# EAGLE design automaton (EAGLE 6.4)

## Sheet 1 of 8: Power
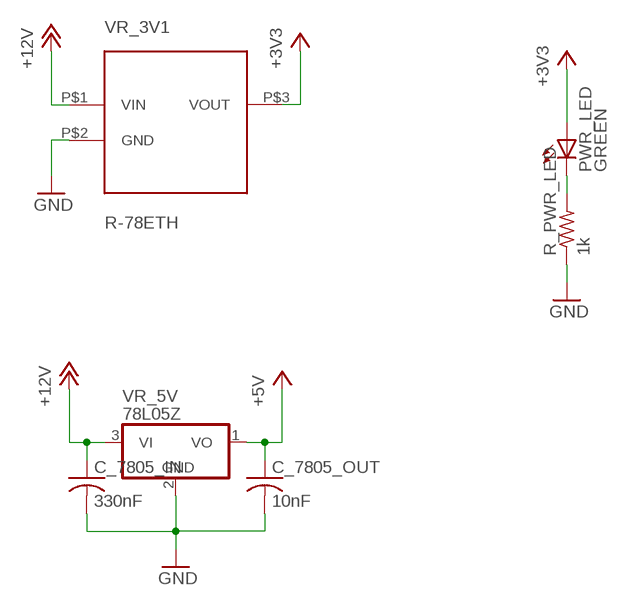
[diagram p0: schematic, sheet 1]

### Parts
C_7805_IN  330nF  C-USC1206  [C1206]
C_7805_OUT  10nF  C-USC1206  [C1206]
PWR_LED  GREEN  LEDCHIPLED_1206  [CHIPLED_1206]
R_PWR_LED  1k  R-US_R1206  [R1206]
VR_3V1  R-78ETH  [R-78E]
VR_5V  78L05Z  [TO92]

### Nets
+3V3 [3v3]: PWR_LED.A VR_3V1.P$3(VOUT) ; also sheet 2,3,4,5,6,7,8
+5V [5v]: C_7805_OUT.1 VR_5V.1(VO) ; also sheet 3
+12V [12v]: C_7805_IN.1 VR_3V1.P$1(VIN) VR_5V.3(VI) ; also sheet 3
GND [gnd]: C_7805_IN.2 C_7805_OUT.2 R_PWR_LED.1 VR_3V1.P$2(GND) VR_5V.2(GND) ; also sheet 2,3,4,5,6,7,8
N$24: PWR_LED.C R_PWR_LED.2

## Sheet 2 of 8: AVR
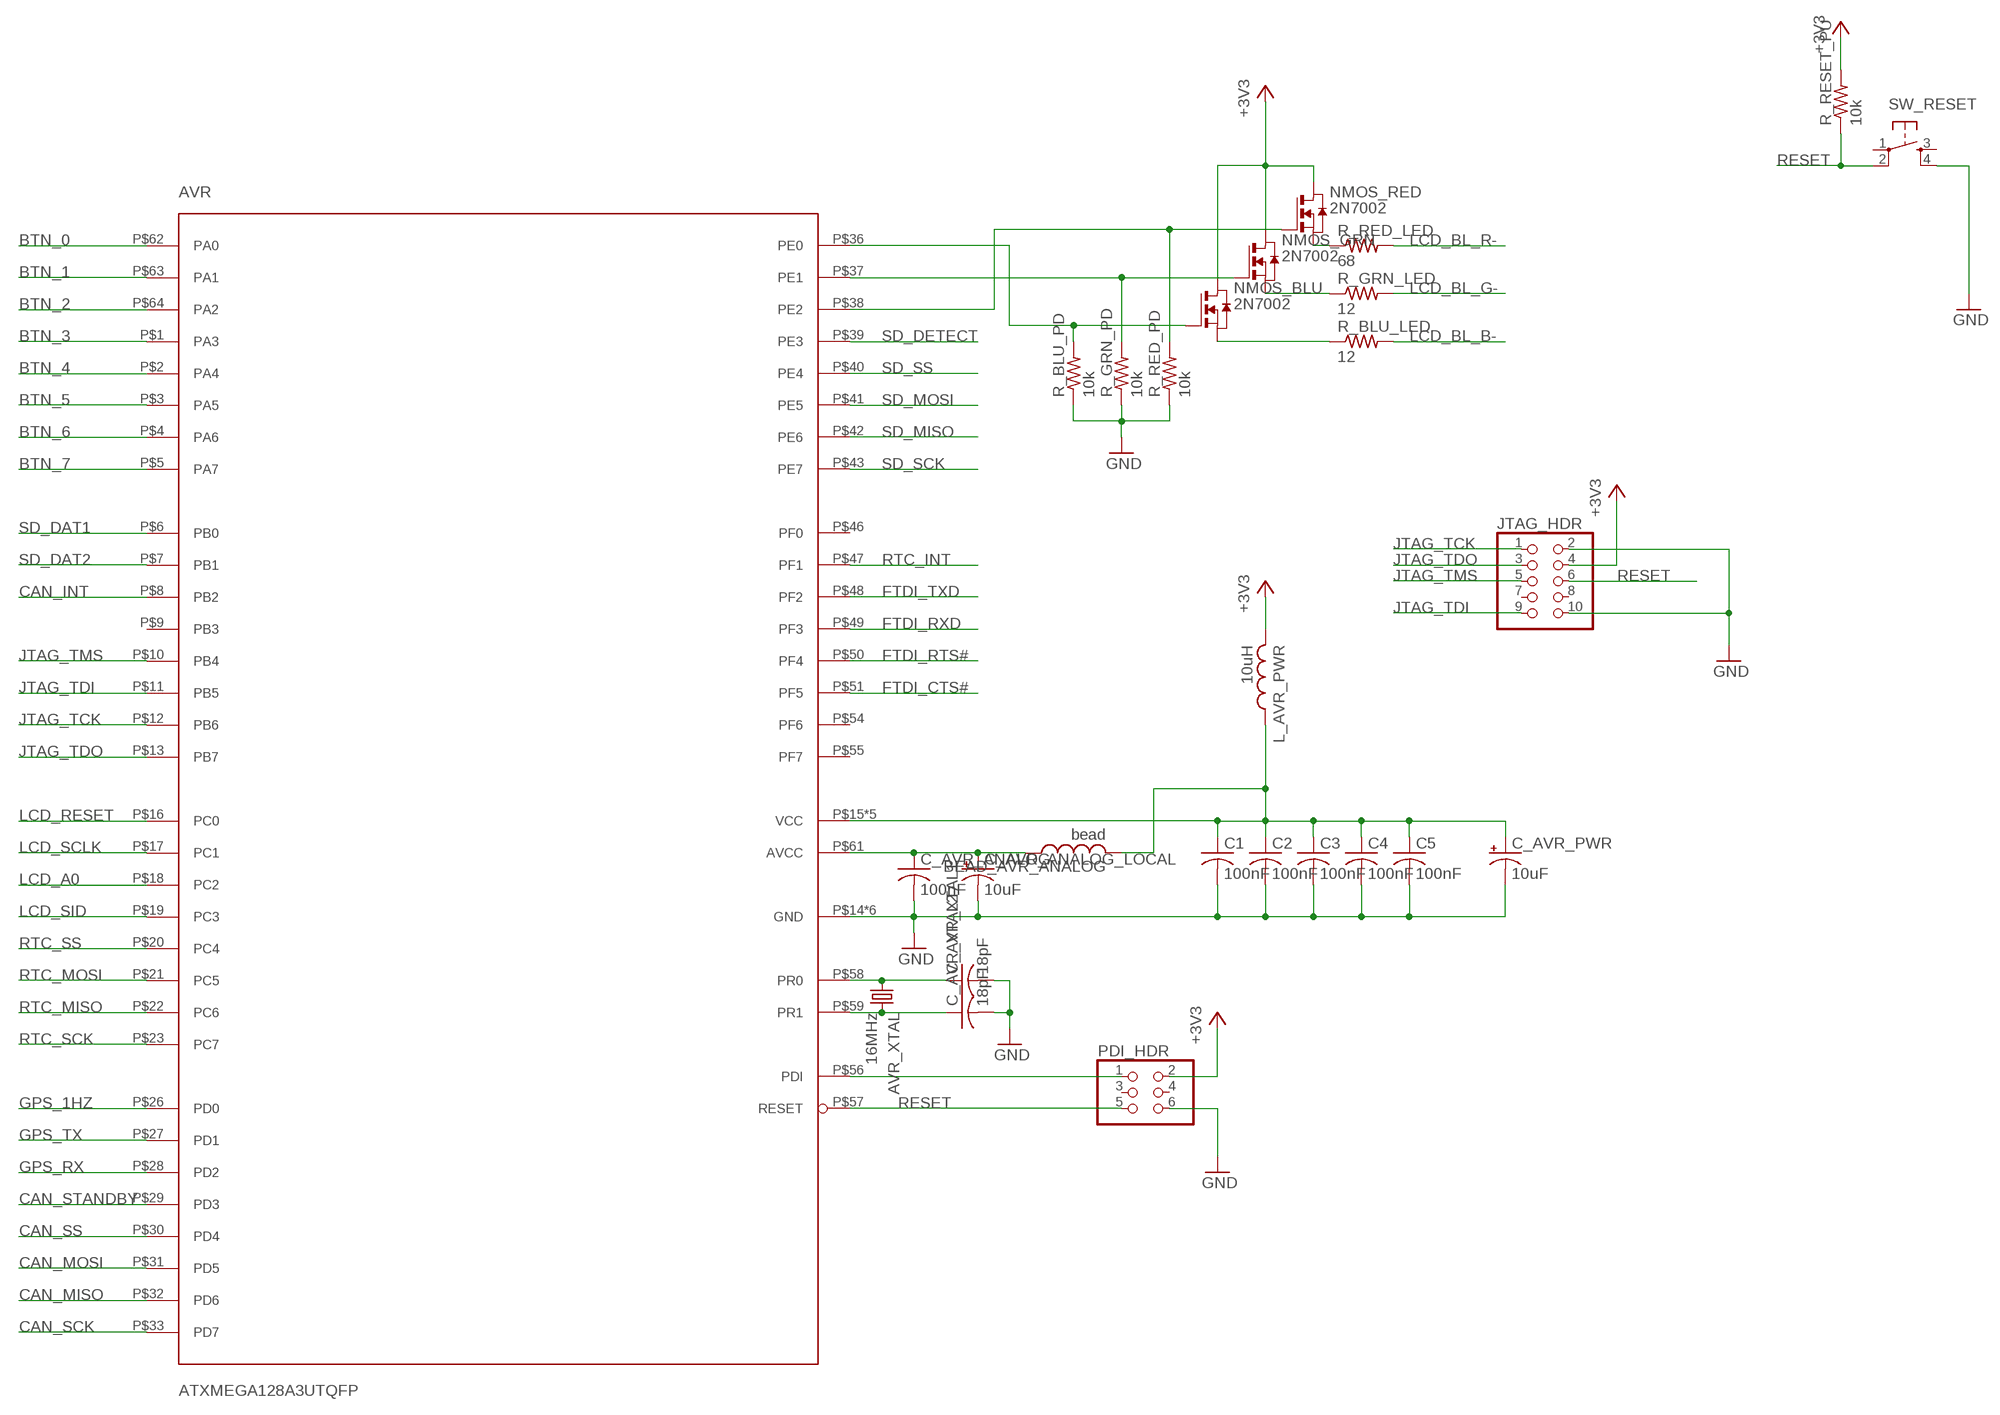
[diagram p1: schematic, sheet 2]

### Parts
AVR  ATXMEGA128A3UTQFP  [ATMEL_TQFP64]
AVR_XTAL  16MHz  CRYSTALHC49S  [HC49/S]
BEAD_AVR_ANALOG  bead  L-USL1812  [L1812]
C1  100nF  C-USC1206  [C1206]
C2  100nF  C-USC1206  [C1206]
C3  100nF  C-USC1206  [C1206]
C4  100nF  C-USC1206  [C1206]
C5  100nF  C-USC1206  [C1206]
C_AVR_ANALOG  100nF  C-USC1206  [C1206]
C_AVR_ANALOG_LOCAL  10uF  CPOL-USE2-5  [E2-5]
C_AVR_PWR  10uF  CPOL-USE2-5  [E2-5]
C_AVR_XTAL1  18pF  C-USC1206  [C1206]
C_AVR_XTAL2  18pF  C-USC1206  [C1206]
JTAG_HDR  PINHD-2X05_2.54  [2X05]
L_AVR_PWR  10uH  L-USL1812  [L1812]
NMOS_BLU  2N7002  NMOSSOT23  [SOT-23]
NMOS_GRN  2N7002  NMOSSOT23  [SOT-23]
NMOS_RED  2N7002  NMOSSOT23  [SOT-23]
PDI_HDR  PINHD-2X03_2.54  [2X03]
R_BLU_LED  12  R-US_R1206  [R1206]
R_BLU_PD  10k  R-US_R1206  [R1206]
R_GRN_LED  12  R-US_R1206  [R1206]
R_GRN_PD  10k  R-US_R1206  [R1206]
R_RED_LED  68  R-US_R1206  [R1206]
R_RED_PD  10k  R-US_R1206  [R1206]
R_RESET_PU  10k  R-US_R1206  [R1206]
SW_RESET  TAC_SWITCHSMD  [TACTILE_SWITCH_SMD]

### Nets
+3V3 [3v3]: JTAG_HDR.4 L_AVR_PWR.2 NMOS_BLU.1(D) NMOS_GRN.1(D) NMOS_RED.1(D) PDI_HDR.2 R_RESET_PU.2 ; also sheet 1,3,4,5,6,7,8
BTN_0: AVR.P$62(PA0) ; also sheet 6
BTN_1: AVR.P$63(PA1) ; also sheet 6
BTN_2: AVR.P$64(PA2) ; also sheet 6
BTN_3: AVR.P$1(PA3) ; also sheet 6
BTN_4: AVR.P$2(PA4) ; also sheet 6
BTN_5: AVR.P$3(PA5) ; also sheet 6
BTN_6: AVR.P$4(PA6) ; also sheet 6
BTN_7: AVR.P$5(PA7) ; also sheet 6
CAN_INT: AVR.P$8(PB2) ; also sheet 3
CAN_MISO: AVR.P$32(PD6) ; also sheet 3
CAN_MOSI: AVR.P$31(PD5) ; also sheet 3
CAN_SCK: AVR.P$33(PD7) ; also sheet 3
CAN_SS: AVR.P$30(PD4) ; also sheet 3
CAN_STANDBY: AVR.P$29(PD3) ; also sheet 3
FTDI_CTS#: AVR.P$51(PF5) ; also sheet 7
FTDI_RTS#: AVR.P$50(PF4) ; also sheet 7
FTDI_RXD: AVR.P$49(PF3) ; also sheet 7
FTDI_TXD: AVR.P$48(PF2) ; also sheet 7
GND [gnd]: AVR.P$14(GND) AVR.P$24(GND) AVR.P$34(GND) AVR.P$44(GND) AVR.P$52(GND) AVR.P$60(GND) C1.2 C2.2 C3.2 C4.2 C5.2 C_AVR_ANALOG.2 C_AVR_ANALOG_LOCAL.- C_AVR_PWR.- C_AVR_XTAL1.2 C_AVR_XTAL2.2 JTAG_HDR.2 JTAG_HDR.10 PDI_HDR.6 R_BLU_PD.1 R_GRN_PD.1 R_RED_PD.1 SW_RESET.4 ; also sheet 1,3,4,5,6,7,8
GPS_1HZ: AVR.P$26(PD0) ; also sheet 4
GPS_RX: AVR.P$28(PD2) ; also sheet 4
GPS_TX: AVR.P$27(PD1) ; also sheet 4
JTAG_TCK: AVR.P$12(PB6) JTAG_HDR.1
JTAG_TDI: AVR.P$11(PB5) JTAG_HDR.9
JTAG_TDO: AVR.P$13(PB7) JTAG_HDR.3
JTAG_TMS: AVR.P$10(PB4) JTAG_HDR.5
LCD_A0: AVR.P$18(PC2) ; also sheet 6
LCD_BL_B- [led]: R_BLU_LED.2 ; also sheet 6
LCD_BL_G- [led]: R_GRN_LED.2 ; also sheet 6
LCD_BL_R- [led]: R_RED_LED.2 ; also sheet 6
LCD_RESET: AVR.P$16(PC0) ; also sheet 6
LCD_SCLK: AVR.P$17(PC1) ; also sheet 6
LCD_SID: AVR.P$19(PC3) ; also sheet 6
N$6: AVR.P$58(PR0) AVR_XTAL.1 C_AVR_XTAL1.1
N$7: AVR.P$59(PR1) AVR_XTAL.2 C_AVR_XTAL2.1
N$18: AVR.P$37(PE1) NMOS_GRN.3(G) R_GRN_PD.2
N$19: AVR.P$36(PE0) NMOS_BLU.3(G) R_BLU_PD.2
N$23 [3v3]: AVR.P$61(AVCC) BEAD_AVR_ANALOG.1 C_AVR_ANALOG.1 C_AVR_ANALOG_LOCAL.+
N$27: AVR.P$38(PE2) NMOS_RED.3(G) R_RED_PD.2
N$28 [3v3]: AVR.P$15(VCC) AVR.P$25(VCC) AVR.P$35(VCC) AVR.P$45(VCC) AVR.P$53(VCC) BEAD_AVR_ANALOG.2 C1.1 C2.1 C3.1 C4.1 C5.1 C_AVR_PWR.+ L_AVR_PWR.1
N$29 [led]: NMOS_BLU.2(S) R_BLU_LED.1
N$30 [led]: NMOS_GRN.2(S) R_GRN_LED.1
N$31 [led]: NMOS_RED.2(S) R_RED_LED.1
PDI_DATA: AVR.P$56(PDI) PDI_HDR.1
RESET: AVR.P$57(RESET) JTAG_HDR.6 PDI_HDR.5 R_RESET_PU.1 SW_RESET.2
RTC_INT: AVR.P$47(PF1) ; also sheet 5
RTC_MISO: AVR.P$22(PC6) ; also sheet 5
RTC_MOSI: AVR.P$21(PC5) ; also sheet 5
RTC_SCK: AVR.P$23(PC7) ; also sheet 5
RTC_SS: AVR.P$20(PC4) ; also sheet 5
SD_DAT1: AVR.P$6(PB0) ; also sheet 8
SD_DAT2: AVR.P$7(PB1) ; also sheet 8
SD_DETECT: AVR.P$39(PE3) ; also sheet 8
SD_MISO: AVR.P$42(PE6) ; also sheet 8
SD_MOSI: AVR.P$41(PE5) ; also sheet 8
SD_SCK: AVR.P$43(PE7) ; also sheet 8
SD_SS: AVR.P$40(PE4) ; also sheet 8
Unconnected: AVR.P$9(PB3) AVR.P$46(PF0) AVR.P$54(PF6) AVR.P$55(PF7) JTAG_HDR.7 JTAG_HDR.8 PDI_HDR.3 PDI_HDR.4 SW_RESET.1 SW_RESET.3

## Sheet 3 of 8: CAN
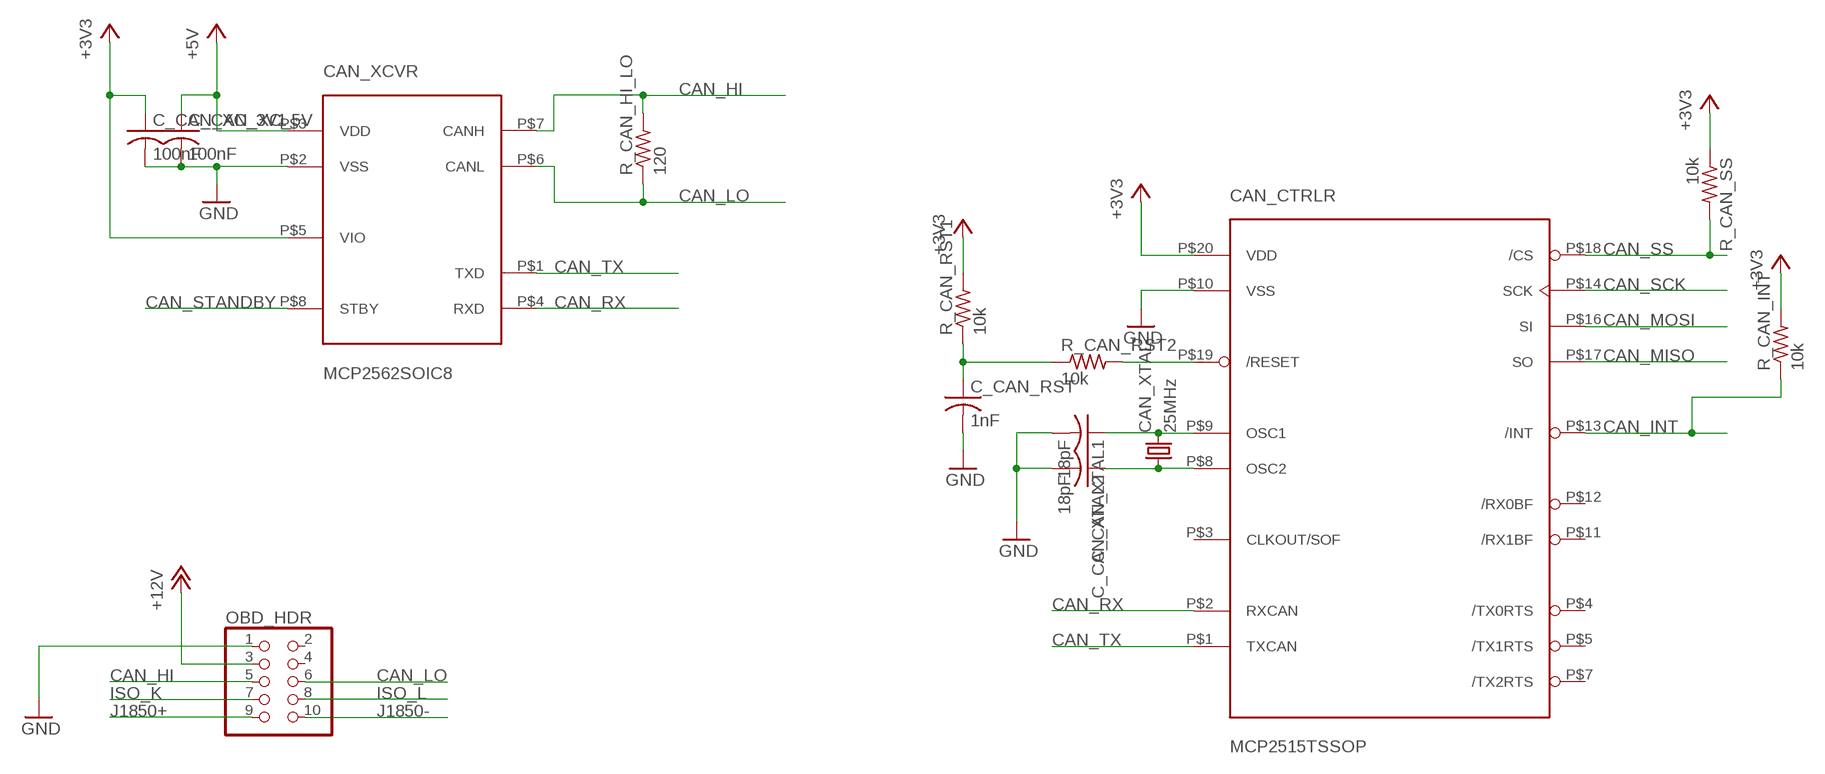
[diagram p2: schematic, sheet 3]

### Parts
C_CAN_RST  1nF  C-USC1206  [C1206]
C_CAN_XC_3V1  100nF  C-USC1206  [C1206]
C_CAN_XC_5V  100nF  C-USC1206  [C1206]
C_CAN_XTAL1  18pF  C-USC1206  [C1206]
C_CAN_XTAL2  18pF  C-USC1206  [C1206]
CAN_CTRLR  MCP2515TSSOP  [MICROCHIP_TSSOP20]
CAN_XCVR  MCP2562SOIC8  [MICROCHIP_SOIC8]
CAN_XTAL  25MHz  CRYSTALHC49S  [HC49/S]
OBD_HDR  PINHD-2X05_2.54-90°  [2X05/90]
R_CAN_HI_LO  120  R-US_R1206  [R1206]
R_CAN_INT  10k  R-US_R1206  [R1206]
R_CAN_RST1  10k  R-US_R1206  [R1206]
R_CAN_RST2  10k  R-US_R1206  [R1206]
R_CAN_SS  10k  R-US_R1206  [R1206]

### Nets
+3V3 [3v3]: C_CAN_XC_3V1.1 CAN_CTRLR.P$20(VDD) CAN_XCVR.P$5(VIO) R_CAN_INT.2 R_CAN_RST1.2 R_CAN_SS.1 ; also sheet 1,2,4,5,6,7,8
+5V [5v]: C_CAN_XC_5V.1 CAN_XCVR.P$3(VDD) ; also sheet 1
+12V [12v]: OBD_HDR.3 ; also sheet 1
CAN_HI: CAN_XCVR.P$7(CANH) OBD_HDR.5 R_CAN_HI_LO.2
CAN_INT: CAN_CTRLR.P$13(/INT) R_CAN_INT.1 ; also sheet 2
CAN_LO: CAN_XCVR.P$6(CANL) OBD_HDR.6 R_CAN_HI_LO.1
CAN_MISO: CAN_CTRLR.P$17(SO) ; also sheet 2
CAN_MOSI: CAN_CTRLR.P$16(SI) ; also sheet 2
CAN_RX: CAN_CTRLR.P$2(RXCAN) CAN_XCVR.P$4(RXD)
CAN_SCK: CAN_CTRLR.P$14(SCK) ; also sheet 2
CAN_SS: CAN_CTRLR.P$18(/CS) R_CAN_SS.2 ; also sheet 2
CAN_STANDBY: CAN_XCVR.P$8(STBY) ; also sheet 2
CAN_TX: CAN_CTRLR.P$1(TXCAN) CAN_XCVR.P$1(TXD)
GND [gnd]: C_CAN_RST.2 C_CAN_XC_3V1.2 C_CAN_XC_5V.2 C_CAN_XTAL1.2 C_CAN_XTAL2.2 CAN_CTRLR.P$10(VSS) CAN_XCVR.P$2(VSS) OBD_HDR.1 ; also sheet 1,2,4,5,6,7,8
ISO_K: OBD_HDR.7
ISO_L: OBD_HDR.8
J1850+: OBD_HDR.9
J1850-: OBD_HDR.10
N$5: C_CAN_RST.1 R_CAN_RST1.1 R_CAN_RST2.1
N$20: C_CAN_XTAL1.1 CAN_CTRLR.P$9(OSC1) CAN_XTAL.2
N$21: C_CAN_XTAL2.1 CAN_CTRLR.P$8(OSC2) CAN_XTAL.1
N$22: CAN_CTRLR.P$19(/RESET) R_CAN_RST2.2
Unconnected: CAN_CTRLR.P$3(CLKOUT/SOF) CAN_CTRLR.P$4(/TX0RTS) CAN_CTRLR.P$5(/TX1RTS) CAN_CTRLR.P$7(/TX2RTS) CAN_CTRLR.P$11(/RX1BF) CAN_CTRLR.P$12(/RX0BF) OBD_HDR.2 OBD_HDR.4

## Sheet 4 of 8: GPS
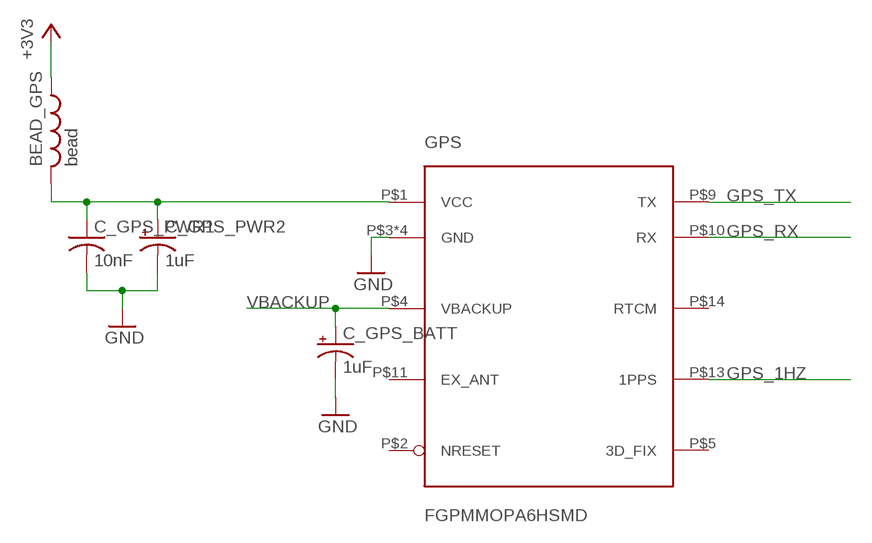
[diagram p3: schematic, sheet 4]

### Parts
BEAD_GPS  bead  L-USL1812  [L1812]
C_GPS_BATT  1uF  CPOL-USE2-5  [E2-5]
C_GPS_PWR1  10nF  C-USC1206  [C1206]
C_GPS_PWR2  1uF  CPOL-USE2-5  [E2-5]
GPS  FGPMMOPA6HSMD  [FGPMMOPA6H]

### Nets
+3V3 [3v3]: BEAD_GPS.1 ; also sheet 1,2,3,5,6,7,8
GND [gnd]: C_GPS_BATT.- C_GPS_PWR1.2 C_GPS_PWR2.- GPS.P$3(GND) GPS.P$8(GND) GPS.P$12(GND) GPS.P$19(GND) ; also sheet 1,2,3,5,6,7,8
GPS_1HZ: GPS.P$13(1PPS) ; also sheet 2
GPS_RX: GPS.P$10(RX) ; also sheet 2
GPS_TX: GPS.P$9(TX) ; also sheet 2
N$1 [3v3]: BEAD_GPS.2 C_GPS_PWR1.1 C_GPS_PWR2.+ GPS.P$1(VCC)
VBACKUP [vbatt]: C_GPS_BATT.+ GPS.P$4(VBACKUP) ; also sheet 5
Unconnected: GPS.P$2(NRESET) GPS.P$5(3D_FIX) GPS.P$11(EX_ANT) GPS.P$14(RTCM)

## Sheet 5 of 8: RTC
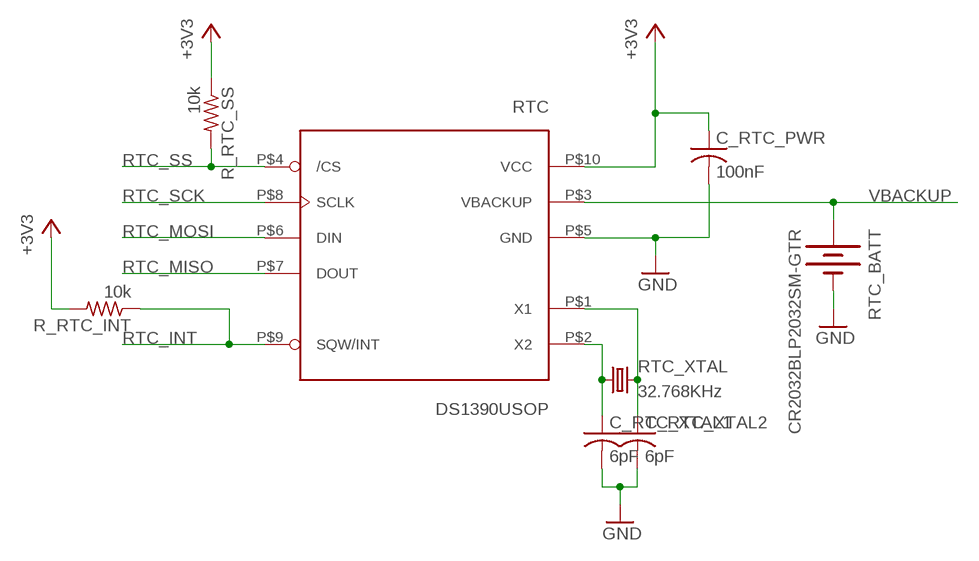
[diagram p4: schematic, sheet 5]

### Parts
C_RTC_PWR  100nF  C-USC1206  [C1206]
C_RTC_XTAL1  6pF  C-USC1206  [C1206]
C_RTC_XTAL2  6pF  C-USC1206  [C1206]
R_RTC_INT  10k  R-US_R1206  [R1206]
R_RTC_SS  10k  R-US_R1206  [R1206]
RTC  DS1390USOP  [MAXIM_10USOP]
RTC_BATT  CR2032BLP2032SM-GTR  [BLP2032SM-GTR]
RTC_XTAL  32.768KHz  CRYSTALTC26V  [TC26V]

### Nets
+3V3 [3v3]: C_RTC_PWR.1 R_RTC_INT.2 R_RTC_SS.1 RTC.P$10(VCC) ; also sheet 1,2,3,4,6,7,8
GND [gnd]: C_RTC_PWR.2 C_RTC_XTAL1.2 C_RTC_XTAL2.2 RTC.P$5(GND) RTC_BATT.P$2(-) ; also sheet 1,2,3,4,6,7,8
N$2: C_RTC_XTAL1.1 RTC.P$2(X2) RTC_XTAL.1
N$3: C_RTC_XTAL2.1 RTC.P$1(X1) RTC_XTAL.2
RTC_INT: R_RTC_INT.1 RTC.P$9(SQW/INT) ; also sheet 2
RTC_MISO: RTC.P$7(DOUT) ; also sheet 2
RTC_MOSI: RTC.P$6(DIN) ; also sheet 2
RTC_SCK: RTC.P$8(SCLK) ; also sheet 2
RTC_SS: R_RTC_SS.2 RTC.P$4(/CS) ; also sheet 2
VBACKUP [vbatt]: RTC.P$3(VBACKUP) RTC_BATT.P$1(+) ; also sheet 4

## Sheet 6 of 8: Front Panel
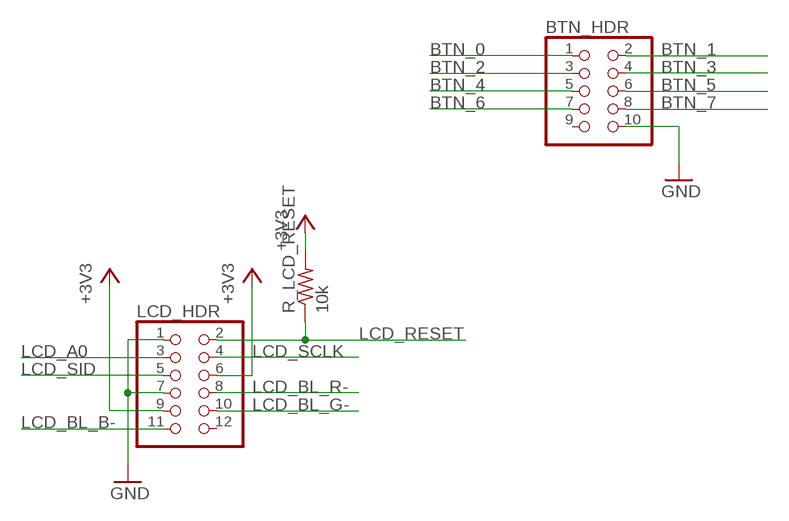
[diagram p5: schematic, sheet 6]

### Parts
BTN_HDR  PINHD-2X05_2.54  [2X05]
LCD_HDR  PINHD-2X06_2.54  [2X06]
R_LCD_RESET  10k  R-US_R1206  [R1206]

### Nets
+3V3 [3v3]: LCD_HDR.6 LCD_HDR.9 R_LCD_RESET.2 ; also sheet 1,2,3,4,5,7,8
BTN_0: BTN_HDR.1 ; also sheet 2
BTN_1: BTN_HDR.2 ; also sheet 2
BTN_2: BTN_HDR.3 ; also sheet 2
BTN_3: BTN_HDR.4 ; also sheet 2
BTN_4: BTN_HDR.5 ; also sheet 2
BTN_5: BTN_HDR.6 ; also sheet 2
BTN_6: BTN_HDR.7 ; also sheet 2
BTN_7: BTN_HDR.8 ; also sheet 2
GND [gnd]: BTN_HDR.10 LCD_HDR.1 LCD_HDR.7 ; also sheet 1,2,3,4,5,7,8
LCD_A0: LCD_HDR.3 ; also sheet 2
LCD_BL_B- [led]: LCD_HDR.11 ; also sheet 2
LCD_BL_G- [led]: LCD_HDR.10 ; also sheet 2
LCD_BL_R- [led]: LCD_HDR.8 ; also sheet 2
LCD_RESET: LCD_HDR.2 R_LCD_RESET.1 ; also sheet 2
LCD_SCLK: LCD_HDR.4 ; also sheet 2
LCD_SID: LCD_HDR.5 ; also sheet 2
Unconnected: BTN_HDR.9 LCD_HDR.12

## Sheet 7 of 8: USB
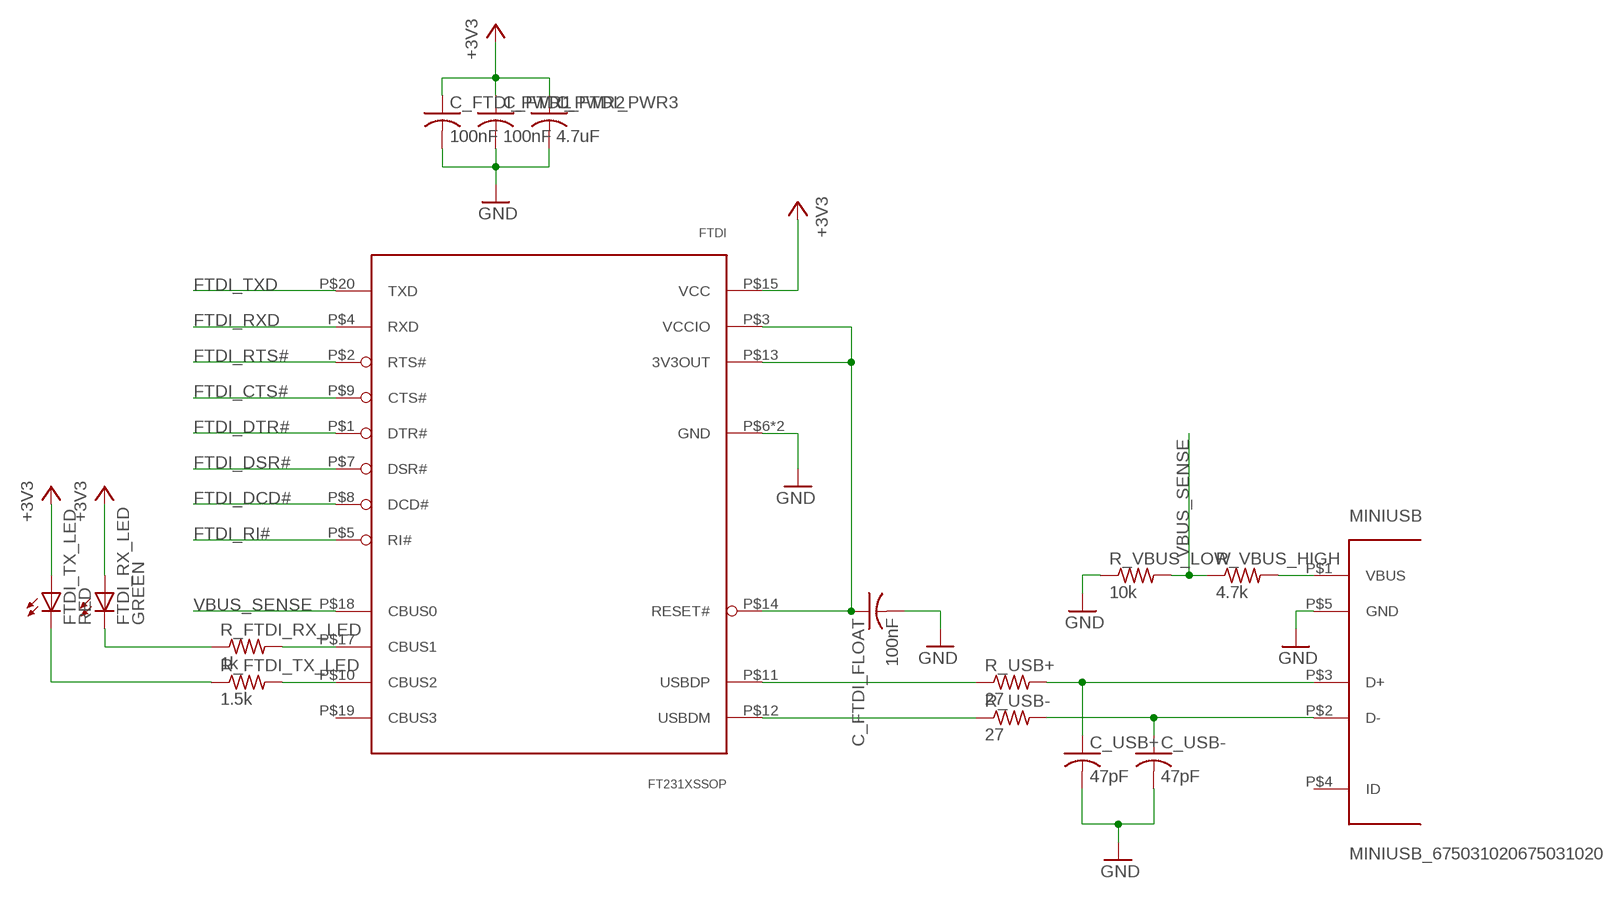
[diagram p6: schematic, sheet 7]

### Parts
C_FTDI_FLOAT  100nF  C-USC1206  [C1206]
C_FTDI_PWR1  100nF  C-USC1206  [C1206]
C_FTDI_PWR2  100nF  C-USC1206  [C1206]
C_FTDI_PWR3  4.7uF  C-USC1206  [C1206]
C_USB+  47pF  C-USC1206  [C1206]
C_USB-  47pF  C-USC1206  [C1206]
FTDI  FT231XSSOP  [FTDI_SSOP20]
FTDI_RX_LED  GREEN  LEDCHIPLED_1206  [CHIPLED_1206]
FTDI_TX_LED  RED  LEDCHIPLED_1206  [CHIPLED_1206]
MINIUSB  MINIUSB_675031020675031020  [MINIUSB_675031020]
R_FTDI_RX_LED  1k  R-US_R1206  [R1206]
R_FTDI_TX_LED  1.5k  R-US_R1206  [R1206]
R_USB+  27  R-US_R1206  [R1206]
R_USB-  27  R-US_R1206  [R1206]
R_VBUS_HIGH  4.7k  R-US_R1206  [R1206]
R_VBUS_LOW  10k  R-US_R1206  [R1206]

### Nets
+3V3 [3v3]: C_FTDI_PWR1.1 C_FTDI_PWR2.1 C_FTDI_PWR3.1 FTDI.P$15(VCC) FTDI_RX_LED.A FTDI_TX_LED.A ; also sheet 1,2,3,4,5,6,8
FTDI_CTS#: FTDI.P$9(CTS#) ; also sheet 2
FTDI_DCD#: FTDI.P$8(DCD#)
FTDI_DSR#: FTDI.P$7(DSR#)
FTDI_DTR#: FTDI.P$1(DTR#)
FTDI_RI#: FTDI.P$5(RI#)
FTDI_RTS#: FTDI.P$2(RTS#) ; also sheet 2
FTDI_RXD: FTDI.P$4(RXD) ; also sheet 2
FTDI_TXD: FTDI.P$20(TXD) ; also sheet 2
GND [gnd]: C_FTDI_FLOAT.2 C_FTDI_PWR1.2 C_FTDI_PWR2.2 C_FTDI_PWR3.2 C_USB+.2 C_USB-.2 FTDI.P$6(GND) FTDI.P$16(GND) MINIUSB.P$5(GND) R_VBUS_LOW.1 ; also sheet 1,2,3,4,5,6,8
N$4: C_FTDI_FLOAT.1 FTDI.P$3(VCCIO) FTDI.P$13(3V3OUT) FTDI.P$14(RESET#)
N$8: FTDI_RX_LED.C R_FTDI_RX_LED.1
N$9: C_USB+.1 MINIUSB.P$3(D+) R_USB+.2
N$10: C_USB-.1 MINIUSB.P$2(D-) R_USB-.2
N$11: FTDI_TX_LED.C R_FTDI_TX_LED.1
N$12: FTDI.P$10(CBUS2) R_FTDI_TX_LED.2
N$13: FTDI.P$17(CBUS1) R_FTDI_RX_LED.2
N$17: MINIUSB.P$1(VBUS) R_VBUS_HIGH.2
USB_N: FTDI.P$12(USBDM) R_USB-.1
USB_P: FTDI.P$11(USBDP) R_USB+.1
VBUS_SENSE: FTDI.P$18(CBUS0) R_VBUS_HIGH.1 R_VBUS_LOW.2
Unconnected: FTDI.P$19(CBUS3) MINIUSB.P$4(ID)

## Sheet 8 of 8: MicroSD
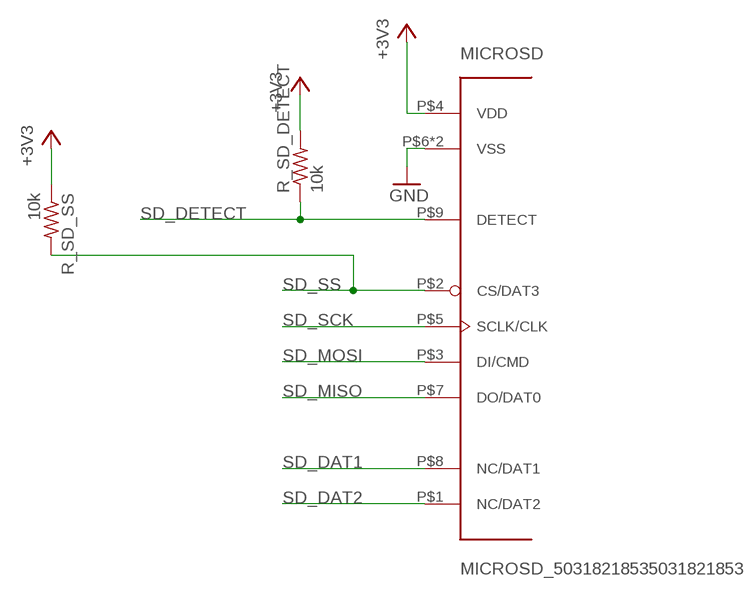
[diagram p7: schematic, sheet 8]

### Parts
MICROSD  MICROSD_50318218535031821853  [MICROSD_5031821853]
R_SD_DETECT  10k  R-US_R1206  [R1206]
R_SD_SS  10k  R-US_R1206  [R1206]

### Nets
+3V3 [3v3]: MICROSD.P$4(VDD) R_SD_DETECT.2 R_SD_SS.1 ; also sheet 1,2,3,4,5,6,7
GND [gnd]: MICROSD.P$6(VSS) MICROSD.P$10(VSS) ; also sheet 1,2,3,4,5,6,7
SD_DAT1: MICROSD.P$8(NC/DAT1) ; also sheet 2
SD_DAT2: MICROSD.P$1(NC/DAT2) ; also sheet 2
SD_DETECT: MICROSD.P$9(DETECT) R_SD_DETECT.1 ; also sheet 2
SD_MISO: MICROSD.P$7(DO/DAT0) ; also sheet 2
SD_MOSI: MICROSD.P$3(DI/CMD) ; also sheet 2
SD_SCK: MICROSD.P$5(SCLK/CLK) ; also sheet 2
SD_SS: MICROSD.P$2(CS/DAT3) R_SD_SS.2 ; also sheet 2

## Library data of the parts
AVR = automaton:ATXMEGA128A3U
AVR_XTAL CAN_XTAL = crystal:CRYSTAL: CRYSTAL; OC_FARNELL: 1667008; OC_NEWARK: unknown
BEAD_AVR_ANALOG BEAD_GPS L_AVR_PWR = rcl:L-US: INDUCTOR, American symbol
BTN_HDR JTAG_HDR OBD_HDR = pinhead-2:PINHD-2X05: PIN HEADER
C1-C5 C_7805_IN C_7805_OUT C_AVR_ANALOG C_AVR_XTAL1 C_AVR_XTAL2 C_CAN_RST C_CAN_XC_3V1 C_CAN_XC_5V C_CAN_XTAL1 C_CAN_XTAL2 C_FTDI_FLOAT C_FTDI_PWR1-C_FTDI_PWR3 C_GPS_PWR1 C_RTC_PWR C_RTC_XTAL1 C_RTC_XTAL2 C_USB+ C_USB- = rcl:C-US: CAPACITOR, American symbol
C_AVR_ANALOG_LOCAL C_AVR_PWR C_GPS_BATT C_GPS_PWR2 = rcl:CPOL-US: POLARIZED CAPACITOR, American symbol
CAN_CTRLR = automaton:MCP2515
CAN_XCVR = automaton:MCP2562
FTDI = automaton:FT231X
FTDI_RX_LED FTDI_TX_LED PWR_LED = led:LED: LED OSRAM: - CHIPLED LG R971, LG N971, LY N971, LG Q971, LY Q971, LO R971, LY R971 LH N974, LH R974 LS Q976, LO Q976, LY Q976 LO Q996 - Hyper CHIPLED LW Q18S LB Q993, LB Q99A, LB R99A - SideLED LS A670, LO A670, LY A670, LG A670, LP A670 LB A673, LV A673, LT A673, LW A673 LH A674 LY A675 LS A676, LA A676, LO A676, LY A676, LW A676 LS A679, LY A679, LG A679 - Hyper Micro SIDELED® LS Y876, LA Y876, LO Y876, LY Y876 LT Y87S - SmartLED LW L88C, LW L88S LB L89C, LB L89S, LG L890 LS L89K, LO L89K, LY L89K LS L896, LA L896, LO L896, LY L896 - TOPLED LS T670, LO T670, LY T670, LG T670, LP T670 LSG T670, LSP T670, LSY T670, LOP T670, LYG T670 LG T671, LOG T671, LSG T671 LB T673, LV T673, LT T673, LW T673 LH T674 LS T676, LA T676, LO T676, LY T676, LB T676, LH T676, LSB T676, LW T676 LB T67C, LV T67C, LT T67C, LS T67K, LO T67K, LY T67K, LW E67C LS E67B, LA E67B, LO E67B, LY E67B, LB E67C, LV E67C, LT E67C LW T67C LS T679, LY T679, LG T679 LS T770, LO T770, LY T770, LG T770, LP T770 LB T773, LV T773, LT T773, LW T773 LH T774 LS E675, LA E675, LY E675, LS T675 LS T776, LA T776, LO T776, LY T776, LB T776 LHGB T686 LT T68C, LB T68C - Hyper Mini TOPLED® LB M676 - Mini TOPLED Santana® LG M470 LS M47K, LO M47K, LY M47K Source: http://www.osram.convergy.de LUXEON: - LUMILED® LXK2-PW12-R00, LXK2-PW12-S00, LXK2-PW14-U00, LXK2-PW14-V00 LXK2-PM12-R00, LXK2-PM12-S00, LXK2-PM14-U00 LXK2-PE12-Q00, LXK2-PE12-R00, LXK2-PE12-S00, LXK2-PE14-T00, LXK2-PE14-U00 LXK2-PB12-K00, LXK2-PB12-L00, LXK2-PB12-M00, LXK2-PB14-N00, LXK2-PB14-P00, LXK2-PB14-Q00 LXK2-PR12-L00, LXK2-PR12-M00, LXK2-PR14-Q00, LXK2-PR14-R00 LXK2-PD12-Q00, LXK2-PD12-R00, LXK2-PD12-S00 LXK2-PH12-R00, LXK2-PH12-S00 LXK2-PL12-P00, LXK2-PL12-Q00, LXK2-PL12-R00 Source: www.luxeon.com KINGBRIGHT: KA-3528ASYC Source: www.kingbright.com
GPS = automaton:FGPMMOPA6H
LCD_HDR = pinhead-2:PINHD-2X06: PIN HEADER
MICROSD = automaton:MICROSD_5031821853
MINIUSB = automaton:MINIUSB_675031020
NMOS_BLU NMOS_GRN NMOS_RED = zetex:NMOSSOT23: MOS FET; OC_FARNELL: unknown; OC_NEWARK: unknown
PDI_HDR = pinhead-2:PINHD-2X03: PIN HEADER
R_BLU_LED R_BLU_PD R_CAN_HI_LO R_CAN_INT R_CAN_RST1 R_CAN_RST2 R_CAN_SS R_FTDI_RX_LED R_FTDI_TX_LED R_GRN_LED R_GRN_PD R_LCD_RESET R_PWR_LED R_RED_LED R_RED_PD R_RESET_PU R_RTC_INT R_RTC_SS R_SD_DETECT R_SD_SS R_USB+ R_USB- R_VBUS_HIGH R_VBUS_LOW = rcl:R-US_: RESISTOR, American symbol
RTC = automaton:DS1390
RTC_BATT = automaton:CR2032
RTC_XTAL = crystal:CRYSTAL: CRYSTAL; OC_FARNELL: unknown; OC_NEWARK: unknown
SW_RESET = SparkFun:TAC_SWITCH: Momentary Switch Button commonly used for reset or general input. Spark Fun Electronics SKU : COM-00097
VR_3V1 = automaton:R-78E
VR_5V = linear:78*: Positive VOLTAGE REGULATOR Source: http://cache.national.com/ds/LM/LM78L05.pdf http://www.fairchildsemi.com/ds/LM/LM7805.pdf

## Net classes
0 default: width 0.2 mm, clearance 0.2 mm
1 gnd: width 0.3 mm, clearance 0.2 mm
2 12v: width 0.6 mm, clearance 0.4 mm
3 3v3: width 0.3 mm, clearance 0.2 mm
4 vbatt: width 0.2 mm, clearance 0.2 mm
5 5v: width 0.3 mm, clearance 0.2 mm
6 led: width 0.3 mm, clearance 0.2 mm

## Board
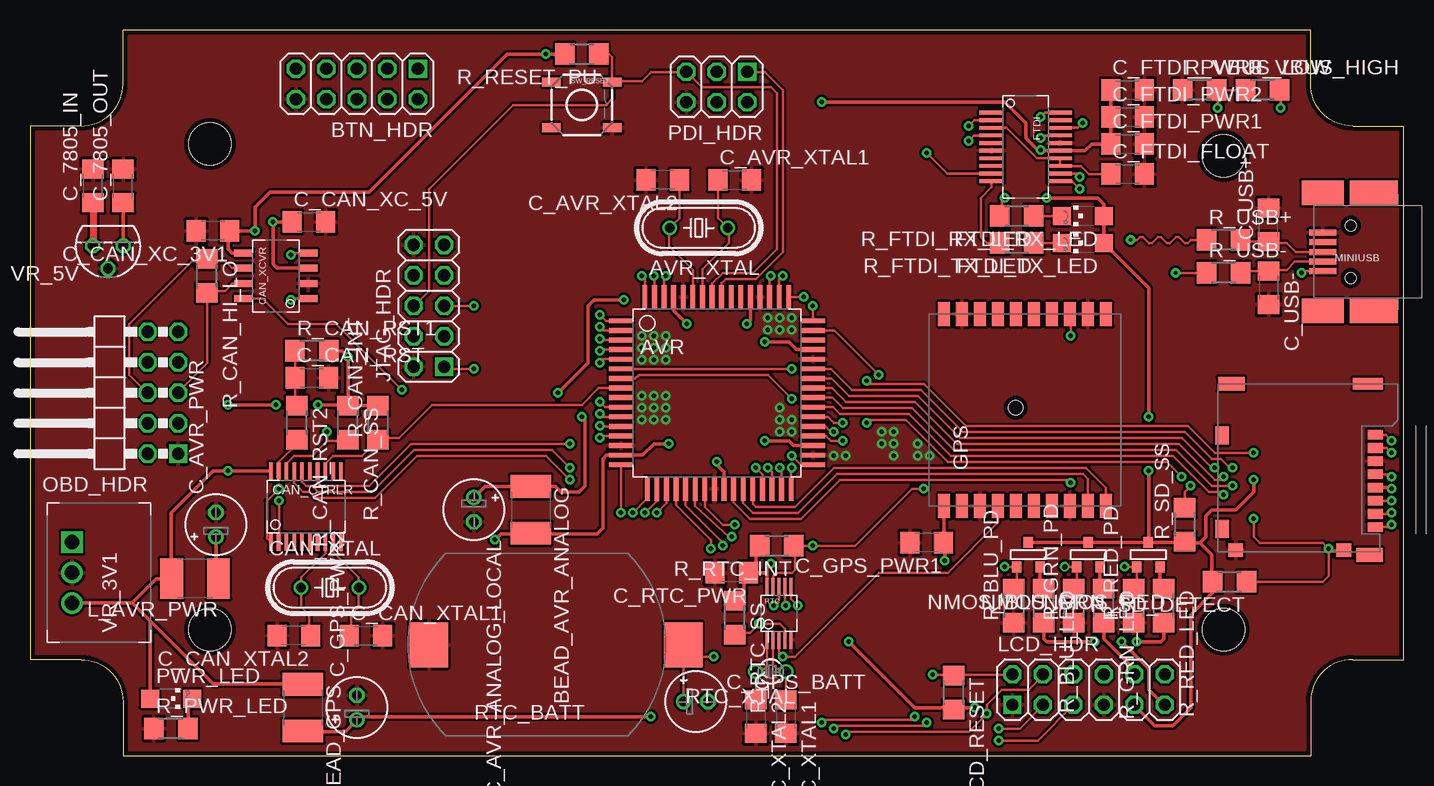
[diagram p8: board, top side]
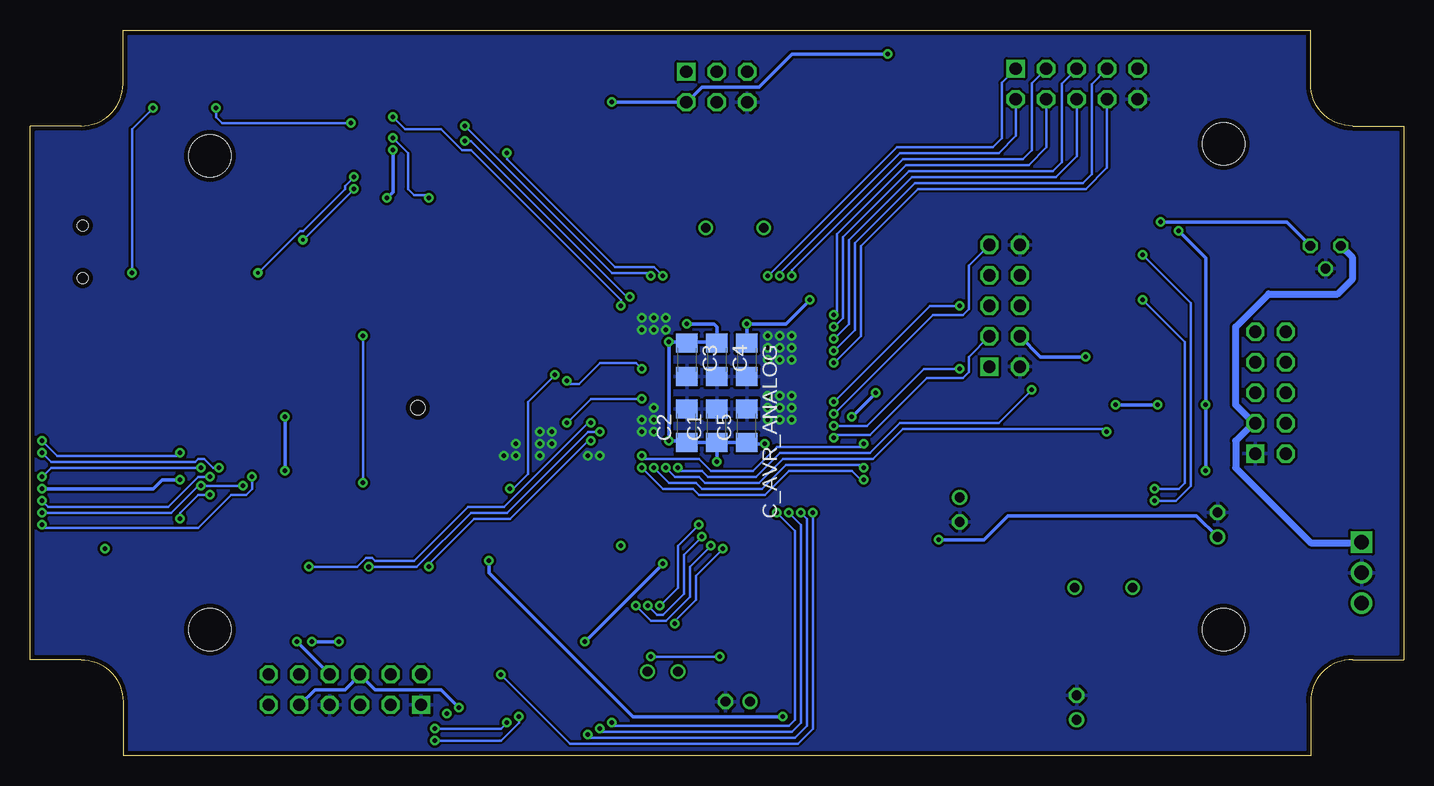
[diagram p9: board, bottom side, seen from below]

Size 114.5 x 60.5 mm. Coordinates in mm from the lower left corner, seen from the top.
Outline: 4.25,8 arc-90 7.75,4.5 7.75,0 106.75,0 106.75,4.5 arc-90 110.25,8 114.5,8 114.5,52.5 110.25,52.5 arc-90 106.75,56 106.75,60.5 7.75,60.5 7.75,56 arc-90 4.25,52.5 0,52.5 0,8 4.25,8
Copper layers (1*16): Top 0.0356mm / dielectric 1.5011mm / Bottom 0.0356mm
Design rules "LaenPCBOrder": minimum track width 6mil, minimum drill 13mil, track to track 6mil, track to pad 6mil, pad to pad 6mil, via to via 6mil, smd to smd 6mil, copper to edge 15mil, drill to drill 6mil, minimum pad ring 7mil, minimum via ring 7mil, stop-mask expansion 3mil, vias tented up to drill 0mil, thermal gap 10mil
Holes 3.5 mm at 15,10.5 99.5,10.5 15,51 99.5,50

### Footprints (pad centres in the part's own frame; a part is rotated, then mirrored left to right if it is on the bottom)
ATMEL_TQFP64 = smd 2 x 0.4: P$1 -8,6; P$2 -8,5.2; P$3 -8,4.4; P$4 -8,3.6; P$5 -8,2.8; P$6 -8,2; P$7 -8,1.2; P$8 -8,0.4; P$9 -8,-0.4; P$10 -8,-1.2; P$11 -8,-2; P$12 -8,-2.8; P$13 -8,-3.6; P$14 -8,-4.4; P$15 -8,-5.2; P$16 -8,-6; P$33 8,-6; P$34 8,-5.2; P$35 8,-4.4; P$36 8,-3.6; P$37 8,-2.8; P$38 8,-2; P$39 8,-1.2; P$40 8,-0.4; P$41 8,0.4; P$42 8,1.2; P$43 8,2; P$44 8,2.8; P$45 8,3.6; P$46 8,4.4; P$47 8,5.2; P$48 8,6 | smd 0.4 x 2: P$17 -5.8,-8; P$18 -5,-8; P$19 -4.2,-8; P$20 -3.4,-8; P$21 -2.6,-8; P$22 -1.8,-8; P$23 -1,-8; P$24 -0.2,-8; P$25 0.6,-8; P$26 1.4,-8; P$27 2.2,-8; P$28 3,-8; P$29 3.8,-8; P$30 4.6,-8; P$31 5.4,-8; P$32 6.2,-8; P$49 6,8; P$50 5.2,8; P$51 4.4,8; P$52 3.6,8; P$53 2.8,8; P$54 2,8; P$55 1.2,8; P$56 0.4,8; P$57 -0.4,8; P$58 -1.2,8; P$59 -2,8; P$60 -2.8,8; P$61 -3.6,8; P$62 -4.4,8; P$63 -5.2,8; P$64 -6,8
HC49/S = drill 0.813: 1 -2.413,0; 2 2.413,0
L1812 = smd 1.9 x 3.4: 1 -1.95,0; 2 1.95,0
2X05 = drill 1.016 square: 1 -5.08,-1.27 | drill 1.016 octagon: 2 -5.08,1.27; 3 -2.54,-1.27; 4 -2.54,1.27; 5 0,-1.27; 6 0,1.27; 7 2.54,-1.27; 8 2.54,1.27; 9 5.08,-1.27; 10 5.08,1.27
C1206 = smd 1.6 x 1.8: 1 -1.4,0; 2 1.4,0
E2-5 = drill 0.813 pad 1.27: + -1.016,0 | drill 0.813 pad 1.27 octagon: - 1.016,0
MICROCHIP_TSSOP20 = smd 0.3 x 1.5: P$1 -2.925,-2.95; P$2 -2.275,-2.95; P$3 -1.625,-2.95; P$4 -0.975,-2.95; P$5 -0.325,-2.95; P$6 0.325,-2.95; P$7 0.975,-2.95; P$8 1.625,-2.95; P$9 2.275,-2.95; P$10 2.925,-2.95; P$11 2.925,2.95; P$12 2.275,2.95; P$13 1.625,2.95; P$14 0.975,2.95; P$15 0.325,2.95; P$16 -0.325,2.95; P$17 -0.975,2.95; P$18 -1.625,2.95; P$19 -2.275,2.95; P$20 -2.925,2.95
MICROCHIP_SOIC8 = smd 0.6 x 1.55: P$1 -1.905,-2.7; P$2 -0.635,-2.7; P$3 0.635,-2.7; P$4 1.905,-2.7; P$5 1.905,2.7; P$6 0.635,2.7; P$7 -0.635,2.7; P$8 -1.905,2.7
FTDI_SSOP20 = smd 0.318 x 2.032: P$1 -2.857,-2.857; P$2 -2.223,-2.857; P$3 -1.587,-2.857; P$4 -0.953,-2.857; P$5 -0.318,-2.857; P$6 0.318,-2.857; P$7 0.953,-2.857; P$8 1.587,-2.857; P$9 2.223,-2.857; P$10 2.857,-2.857; P$11 2.857,2.857; P$12 2.223,2.857; P$13 1.587,2.857; P$14 0.953,2.857; P$15 0.318,2.857; P$16 -0.318,2.857; P$17 -0.953,2.857; P$18 -1.587,2.857; P$19 -2.223,2.857; P$20 -2.857,2.857
CHIPLED_1206 = smd 1.5 x 1.5: A 0,-1.75; C 0,1.75
FGPMMOPA6H = smd 2 x 1: P$1 -8,6.75; P$2 -8,5.25; P$3 -8,3.75; P$4 -8,2.25; P$5 -8,0.75; P$6 -8,-0.75; P$7 -8,-2.25; P$8 -8,-3.75; P$9 -8,-5.25; P$10 -8,-6.75; P$11 8,-6.75; P$12 8,-5.25; P$13 8,-3.75; P$14 8,-2.25; P$15 8,-0.75; P$16 8,0.75; P$17 8,2.25; P$18 8,3.75; P$19 8,5.25; P$20 8,6.75 | hole 1.2: 0.2,0.8
2X06 = drill 1.016 square: 1 -6.35,-1.27 | drill 1.016 octagon: 2 -6.35,1.27; 3 -3.81,-1.27; 4 -3.81,1.27; 5 -1.27,-1.27; 6 -1.27,1.27; 7 1.27,-1.27; 8 1.27,1.27; 9 3.81,-1.27; 10 3.81,1.27; 11 6.35,-1.27; 12 6.35,1.27
MICROSD_5031821853 = smd 0.8 x 1.25: P$1 4.95,5.625; P$2 3.85,5.625; P$3 2.75,5.625; P$4 1.65,5.625; P$5 0.55,5.625; P$6 -0.55,5.625; P$7 -1.65,5.625; P$8 -2.75,5.625 | smd 1.15 x 1.25: P$9 6.875,3 | smd 1.15 x 1.2: P$10 6.875,-6 | smd 0.95 x 2.5: P$11 -7,5 | smd 1.15 x 2.2: P$12 -7,-6.35; P$13 7.275,5.175 | smd 1.5 x 1.15: P$14 -2.7,-7.125; P$15 5.1,-7.125
MINIUSB_675031020 = smd 2.25 x 0.5: P$1 3.75,1.6; P$2 3.75,0.8; P$3 3.75,0; P$4 3.75,-0.8; P$5 3.75,-1.6 | smd 4 x 2.05: P$6 -0.5,-4.925; P$7 -0.5,4.925 | smd 3.5 x 2.05: P$8 3.75,-4.925; P$9 3.75,4.925 | hole 0.9: 1.4,2.2; 1.4,-2.2
SOT-23 = smd 0.787 x 0.889: 1 0.025,-1.016; 2 -0.94,1.016; 3 0.991,1.016
2X05/90 = drill 1.016 square: 1 -5.08,-6.35 | drill 1.016 octagon: 2 -5.08,-3.81; 3 -2.54,-6.35; 4 -2.54,-3.81; 5 0,-6.35; 6 0,-3.81; 7 2.54,-6.35; 8 2.54,-3.81; 9 5.08,-6.35; 10 5.08,-3.81
2X03 = drill 1.016 square: 1 -2.54,-1.27 | drill 1.016 octagon: 2 -2.54,1.27; 3 0,-1.27; 4 0,1.27; 5 2.54,-1.27; 6 2.54,1.27
R1206 = smd 1.6 x 1.803: 1 -1.422,0; 2 1.422,0
MAXIM_10USOP = smd 0.25 x 1.5: P$1 -1,-2.2; P$2 -0.5,-2.2; P$3 0,-2.2; P$4 0.5,-2.2; P$5 1,-2.2; P$6 1,2.2; P$7 0.5,2.2; P$8 0,2.2; P$9 -0.5,2.2; P$10 -1,2.2
BLP2032SM-GTR = smd 3.2 x 3.75: P$1 -12.2,0; P$2 9,0
TC26V = drill 0.813: 1 -1.27,0; 2 1.27,0
TACTILE_SWITCH_SMD = smd 1.524 x 0.762: 1 -2.54,1.905; 2 2.54,1.905; 3 -2.54,-1.905; 4 2.54,-1.905
R-78E = drill 1.2 square: P$1 2.54,2.25 | drill 1.2: P$2 0,2.25; P$3 -2.54,2.25
TO92 = drill 0.813 octagon: 1 -1.27,0; 2 0,1.905; 3 1.27,0

### Placement (x,y rotation side)
AVR  57.25,30.25 0 top
AVR_XTAL  55.75,44 180 top
BEAD_AVR_ANALOG  41.75,20.5 270 top
BEAD_GPS  22.75,4 270 top
BTN_HDR  27.25,56 180 top
C1  57.25,27.5 90 bottom
C2  59.75,27.5 90 bottom
C3  59.75,33 270 bottom
C4  57.25,33 270 bottom
C5  54.75,27.5 90 bottom
C_7805_IN  5.25,47.5 90 top
C_7805_OUT  7.75,47.5 90 top
C_AVR_ANALOG  54.75,33 270 bottom
C_AVR_ANALOG_LOCAL  37,20.5 270 top
C_AVR_PWR  15.5,19.25 90 top
C_AVR_XTAL1  58.75,48 0 top
C_AVR_XTAL2  52.75,48 180 top
C_CAN_RST  23.5,31.5 0 top
C_CAN_XC_3V1  15.25,43.75 180 top
C_CAN_XC_5V  23.25,44.5 0 top
C_CAN_XTAL1  28,10 0 top
C_CAN_XTAL2  22,10 180 top
C_FTDI_FLOAT  91.5,48.5 0 top
C_FTDI_PWR1  91.5,51 0 top
C_FTDI_PWR2  91.5,53.25 0 top
C_FTDI_PWR3  91.5,55.5 0 top
C_GPS_BATT  55.5,4.5 0 top
C_GPS_PWR1  74.75,17.75 180 top
C_GPS_PWR2  27.25,4 90 top
C_RTC_PWR  58.5,15.25 180 top
C_RTC_XTAL1  63,3.25 270 top
C_RTC_XTAL2  60.5,3.25 270 top
C_USB+  103.25,44.25 90 top
C_USB-  103.25,39 270 top
CAN_CTRLR  23,20.75 0 top
CAN_XCVR  20.5,40 90 top
CAN_XTAL  25,14 0 top
FTDI  83,50.75 270 top
FTDI_RX_LED  87.75,45 90 top
FTDI_TX_LED  87.75,42.75 90 top
GPS  82.95,28.8 90 top
JTAG_HDR  33.25,37.5 90 top
L_AVR_PWR  13.75,14.75 180 top
LCD_HDR  88.25,5.5 0 top
MICROSD  106.5,24 270 top
MINIUSB  111.5,42 180 top
NMOS_BLU  83.25,16.75 180 top
NMOS_GRN  88.25,16.75 180 top
NMOS_RED  93.25,16.75 180 top
OBD_HDR  6,30.25 90 top
PDI_HDR  57.25,55.75 180 top
PWR_LED  11.75,4.75 270 top
R_BLU_LED  84.5,12.5 270 top
R_BLU_PD  82,12.5 90 top
R_CAN_HI_LO  14.75,40 270 top
R_CAN_INT  29,27.75 90 top
R_CAN_RST1  23.5,33.75 0 top
R_CAN_RST2  22.25,27.75 270 top
R_CAN_SS  26.5,27.75 270 top
R_FTDI_RX_LED  82.25,45 180 top
R_FTDI_TX_LED  82.25,42.75 180 top
R_GRN_LED  89.5,12.5 270 top
R_GRN_PD  87,12.5 90 top
R_LCD_RESET  77,5.25 270 top
R_PWR_LED  11.75,2.25 0 top
R_RED_LED  94.5,12.5 270 top
R_RED_PD  92,12.5 90 top
R_RESET_PU  46,58.5 180 top
R_RTC_INT  62.25,17.5 180 top
R_RTC_SS  58.75,11.5 270 top
R_SD_DETECT  100,14.5 180 top
R_SD_SS  96.25,19.25 90 top
R_USB+  99.5,43 0 top
R_USB-  99.5,40.25 0 top
R_VBUS_HIGH  102.75,55.5 0 top
R_VBUS_LOW  97.5,55.5 0 top
RTC  62.45,11.85 0 top
RTC_BATT  42.25,9.25 180 top
RTC_XTAL  61.75,7 180 top
SW_RESET  46,54.25 0 top
VR_3V1  5.75,15.25 90 top
VR_5V  6.5,42.5 180 top

### Tracks (layer width: path | path; a pad name or v marks a point on that pad's centre or on a via)
+3V3  (via drill 0.4 pad 0.8)
  Top 0.3: NMOS_RED.1 NMOS_GRN.1 NMOS_BLU.1 | NMOS_RED.1 96.19,17.77 R_SD_SS.1 96.33,17.75 97.5,17.75 | MICROSD.P$4 113.4,22.35 v113.5,22.25 | v102,23 102,22 100.5,20.5 98.5,20.5 98,20 98,18.25 97.5,17.75 | 97.5,17.75 98.5,16.75 98.5,14.58 R_SD_DETECT.2 98.58,13.58 96.75,11.75 96.75,4 95.25,2.5 93.75,2.5 92.02,4.23 LCD_HDR.9 | C_FTDI_PWR3.1 C_FTDI_PWR2.1 C_FTDI_PWR1.1 88.5,51 87.93,50.43 FTDI.P$15 84.32,50.43 v84.25,50.5 84,50.5 83,51.5 83,52.75 81.25,54.5 v66,54.5 | v84.75,46.5 89,46.5 89.5,46 FTDI_RX_LED.A FTDI_TX_LED.A 93.25,39 v93.25,28.25 | CAN_XCVR.P$5 16.84,41.91 16.5,42.25 16.5,43.6 C_CAN_XC_3V1.1 | 8.5,12.75 10.5,14.75 L_AVR_PWR.2 11.8,15.95 11.75,16 11.75,20.25 15.25,23.75 v16.5,23.75 20.02,23.75 CAN_CTRLR.P$20 | 8.5,12.75 3.54,12.75 VR_3V1.P$3 | 8.5,12.75 10,11.25 | 10,11.25 PWR_LED.A | BEAD_GPS.1 22.75,6 15.25,6 10,11.25 | R_CAN_SS.1 R_CAN_INT.2 | R_RESET_PU.2 v43,58.5 39.75,58.5 28.25,47 20,47 18.75,45.75 v18.75,43.75 C_CAN_XC_3V1.1 | 61.45,15.05 RTC.P$10 61.45,15.25 | 61.45,15.25 C_RTC_PWR.1 | R_RTC_INT.2 60.83,17.33 60.5,17 60.5,15.85 C_RTC_PWR.1 | C_RTC_PWR.1 59.9,15.15 59.5,14.75 59.5,13.5 59.25,13.25 59.08,13.25 R_RTC_SS.1 | 93.25,17.79 NMOS_RED.1 | 93.25,17.79 93.25,17.75 | 93.25,17.79 v93.25,23.75 | R_CAN_SS.1 26.33,29.17 26.25,29.25 v24,29.25 | R_CAN_RST1.2 26,33.75 v26.5,33.25 R_CAN_SS.1 | 16.5,43.9 C_CAN_XC_3V1.1 | v16.5,29.25 v20.5,29.25 | 61.45,15.25 61.45,15.7 v61.75,16 | v78.75,4 77.17,4 R_LCD_RESET.2 76.83,4 73.75,4 v68.25,9.5
  Bottom 0.3: v113.5,22.25 104.25,22.25 103.5,23 v102,23 | v84.25,50.5 84.25,47 v84.75,46.5 | v43,58.5 51,58.5 53.75,55.75 58.5,55.75 59.5,54.75 59.52,54.75 PDI_HDR.2 59.81,54.5 v66,54.5 | v93.25,23.75 v93.25,28.25 | v26.5,33.25 30.27,33.25 JTAG_HDR.4 | v16.5,23.75 v16.5,29.25 16.5,41.5 v18.75,43.75 | v24,29.25 v20.5,29.25 | LCD_HDR.9 92.02,4.23 90.75,5.5 88.25,5.5 LCD_HDR.6 86.98,6.73 85.75,5.5 80.25,5.5 v78.75,4 | v61.75,16 v68.25,9.5
+5V  (via drill 0.4 pad 0.8)
  Top 0.3: C_7805_OUT.1 7.75,42.5 VR_5V.1 | 21.75,44.4 C_CAN_XC_5V.1 v20.25,44.5 20.25,41 20.61,40.63 CAN_XCVR.P$3
  Bottom 0.3: v20.25,44.5 9.75,44.5 7.75,42.5 VR_5V.1
+12V
  Top 0.6: C_7805_IN.1 5.25,42.52 VR_5V.3
  Bottom 0.6: 12.5,27.75 14,29.25 14,35.75 11.25,38.5 5.5,38.5 4.25,39.75 4.25,41.52 VR_5V.3 | OBD_HDR.3 12.46,27.71 12.5,27.75 | 12.5,27.75 14,26.25 14,24 7.75,17.75 3.54,17.75 VR_3V1.P$1
BTN_0  (via drill 0.4 pad 0.8)
  Top 0.2: AVR.P$62 52.85,39.85 v53,40
  Bottom 0.2: v53,40 42.25,50.75 34.25,50.75 33.5,51.5 33.5,56.1 BTN_HDR.1
BTN_1  (via drill 0.4 pad 0.8)
  Top 0.2: AVR.P$63 52.05,39.95 v52,40
  Bottom 0.2: v52,40 52,40.25 42,50.25 33.75,50.25 32.33,51.67 BTN_HDR.2
BTN_2  (via drill 0.4 pad 0.8)
  Top 0.2: AVR.P$64 51.25,39.75 v51,40
  Bottom 0.2: v51,40 51,40.5 41.75,49.75 31.75,49.75 31,50.5 31,56.06 BTN_HDR.3
BTN_3  (via drill 0.4 pad 0.8)
  Top 0.2: AVR.P$1 48,36.25 v47.5,36.75
  Bottom 0.2: v47.5,36.75 47.25,37 47.25,43.5 41.5,49.25 31.25,49.25 29.79,50.71 BTN_HDR.4
BTN_4  (via drill 0.4 pad 0.8)
  Top 0.2: AVR.P$2 47.8,35.45 v47.5,35.75
  Bottom 0.2: v47.5,35.75 46.75,36.5 46.75,43.25 41.25,48.75 29.25,48.75 28.5,49.5 28.5,56.02 BTN_HDR.5
BTN_5  (via drill 0.4 pad 0.8)
  Top 0.2: AVR.P$3 47.6,34.65 v47.5,34.75
  Bottom 0.2: v47.5,34.75 46.25,36 46.25,43 41,48.25 29,48.25 27.25,50 BTN_HDR.6
BTN_6  (via drill 0.4 pad 0.8)
  Top 0.2: AVR.P$4 47.6,33.85 v47.5,33.75
  Bottom 0.2: v47.5,33.75 45.75,35.5 45.75,42.75 40.75,47.75 26.75,47.75 26,48.5 26,55.98 BTN_HDR.7
BTN_7  (via drill 0.4 pad 0.8)
  Top 0.2: AVR.P$5 47.8,33.05 v47.5,32.75
  Bottom 0.2: v47.5,32.75 45.25,35 45.25,42.5 40.5,47.25 26.5,47.25 24.71,49.04 BTN_HDR.8
CAN_HI
  Top 0.2: CAN_XCVR.P$7 16.86,39.37 16.25,38.75 14.92,38.75 R_CAN_HI_LO.2 14.75,32.75 12.75,30.75 12.75,30.65 OBD_HDR.5
CAN_INT
  Top 0.2: CAN_CTRLR.P$13 24.62,24.38 25.25,25 27.67,25 R_CAN_INT.1 29.17,26.5 30.75,26.5 33.5,29.25 46,29.25 47.4,30.65 AVR.P$8
CAN_LO
  Top 0.2: CAN_XCVR.P$6 16.86,40.63 16.25,41.25 14.92,41.25 | 14.92,41.25 R_CAN_HI_LO.1 | 14.92,41.25 13.5,41.25 8.25,36 8.25,31.75 9.5,30.5 9.56,30.5 OBD_HDR.6
CAN_MISO  (via drill 0.4 pad 0.8)
  Top 0.2: AVR.P$32 63.45,23.95 v63.5,24 | CAN_CTRLR.P$17 22.02,22.73 22.75,22 23.25,22 23.75,21.5 28.75,21.5 32.25,25 43,25 v45,23
  Bottom 0.2: v63.5,24 61.75,22.25 59.25,22.25 58.75,21.75 53.25,21.75 51.25,23.75 46,23.75 45.25,23 v45,23
CAN_MOSI  (via drill 0.4 pad 0.8)
  Top 0.2: AVR.P$31 62.65,23.85 v62.5,24 | CAN_CTRLR.P$16 22.68,22.82 23,22.5 23.5,22.5 24,22 28.5,22 32,25.5 43.5,25.5 v45,24
  Bottom 0.2: v62.5,24 61.25,22.75 59,22.75 58.5,22.25 53.5,22.25 51.5,24.25 45.25,24.25 v45,24
CAN_RX  (via drill 0.4 pad 0.8)
  Top 0.2: CAN_XCVR.P$4 21.91,41.91 v21.75,41.75 | v20.75,21.25 20.75,17.82 CAN_CTRLR.P$2
  Bottom 0.2: v21.75,41.75 17.75,37.75 17.75,22.5 19,21.25 v20.75,21.25
CAN_SCK  (via drill 0.4 pad 0.8)
  Top 0.2: AVR.P$33 64.25,24.25 v63.5,25 | CAN_CTRLR.P$14 23.98,22.77 24.25,22.5 28.25,22.5 31.75,26 v45,26
  Bottom 0.2: v63.5,25 63.25,24.75 58.75,24.75 57.75,23.75 54.25,23.75 52.25,25.75 45.25,25.75 v45,26
CAN_SS  (via drill 0.4 pad 0.8)
  Top 0.2: CAN_CTRLR.P$18 21.38,24.38 22,25 23.5,25 24.75,26.25 | R_CAN_SS.2 26.42,26.25 24.75,26.25 | AVR.P$30 61.85,23.65 v61.5,24 | v24.75,27 24.75,26.25
  Bottom 0.2: v61.5,24 60.75,23.25 58.75,23.25 58.25,22.75 53.75,22.75 51.75,24.75 44.25,24.75 41.75,27.25 25,27.25 v24.75,27
CAN_STANDBY  (via drill 0.4 pad 0.8)
  Top 0.2: AVR.P$29 61.05,23.45 v60.5,24 | CAN_XCVR.P$8 19.41,38.09 21.5,36 25.5,36 v31,30.5
  Bottom 0.2: v60.5,24 60.25,23.75 58.5,23.75 58,23.25 54,23.25 52,25.25 44.5,25.25 42,27.75 33.75,27.75 v31,30.5
CAN_TX  (via drill 0.4 pad 0.8)
  Top 0.2: CAN_XCVR.P$1 21.84,38.09 v21.75,38 | v20.75,22.25 19.75,21.25 19.75,18.12 CAN_CTRLR.P$1
  Bottom 0.2: v21.75,38 18.25,34.5 18.25,22.75 18.75,22.25 v20.75,22.25
FTDI_CTS#  (via drill 0.4 pad 0.8)
  Top 0.2: FTDI.P$9 76.47,48.53 v74.75,50.25 | AVR.P$51 61.65,39.9 v61.75,40
  Bottom 0.2: v74.75,50.25 74.75,49.75 65.75,40.75 62.5,40.75 v61.75,40
FTDI_RTS#  (via drill 0.4 pad 0.8)
  Top 0.2: FTDI.P$2 78.72,52.97 v78.25,52.5 | AVR.P$50 62.45,39.7 v62.75,40
  Bottom 0.2: v78.25,52.5 66,40.25 63,40.25 v62.75,40
FTDI_RXD  (via drill 0.4 pad 0.8)
  Top 0.2: FTDI.P$4 78.7,51.7 v78.25,51.25 | AVR.P$49 v64.5,38.25
  Bottom 0.2: v78.25,51.25 77.75,51.25 64.75,38.25 v64.5,38.25
FTDI_TXD  (via drill 0.4 pad 0.8)
  Top 0.2: FTDI.P$20 84.61,53.61 v84.25,53.25 | AVR.P$48 v65.25,37.5
  Bottom 0.2: v84.25,53.25 83.25,52.25 80.25,52.25 78.5,50.5 77.75,50.5 65.25,38 v65.25,37.5
GND  (via drill 0.4 pad 0.8)
  other vias: 51,30 67,25 68,25 72,27 72,26 72,25 71,26 71,27 74,25 74,26 75,25 52,30 53,30 53,29 52,29 51,29 51,28 52,28 53,28 53,33 53,34 53,35 52,35 51,35 51,34 51,33 52,33 52,34 62.5,36.5 63.5,36.5 61.5,36.5 62.5,27 62.5,28 62.5,29 63.5,28 63.5,27 61.5,35.5 62.5,35.5 63.5,35.5
  pour Top: 4.25,52 arc90 8.25,56 8.25,60 106.25,60 106.25,56 arc90 110.25,52 114,52 114,8.5 110.25,8.5 arc90 106.25,4.5 106.25,0.5 8.25,0.5 8.25,4.5 arc90 4.25,8.5 0.5,8.5 0.5,52
  pour Bottom: 4.25,52 arc90 8.25,56 8.25,60 106.25,60 106.25,56 arc90 110.25,52 114,52 114,8.5 110.25,8.5 arc90 106.25,4.5 106.25,0.5 8.25,0.5 8.25,4.5 arc90 4.25,8.5 0.5,8.5 0.5,52
GPS_1HZ  (via drill 0.4 pad 0.8)
  Top 0.2: AVR.P$26 58.65,21.1 60,19.75 64.25,19.75 67.5,23 86.5,23 v86.75,22.75 | v86.75,35 86.75,36.75 GPS.P$13
  Bottom 0.2: v86.75,22.75 v86.75,35
GPS_RX
  Top 0.2: GPS.P$10 89.7,22.3 88,24 67,24 63.75,20.75 60.5,20.75 60.25,21 AVR.P$28
GPS_TX
  Top 0.2: GPS.P$9 88.2,23.05 87.75,23.5 67.25,23.5 64,20.25 60.25,20.25 59.45,21.05 AVR.P$27
JTAG_TCK  (via drill 0.4 pad 0.8)
  Top 0.2: AVR.P$12 47.55,27.45 v47.5,27.5 | v37,32.25 34.69,32.25 JTAG_HDR.1
  Bottom 0.2: v47.5,27.5 44.75,27.5 40,32.25 v37,32.25
JTAG_TDI  (via drill 0.4 pad 0.8)
  Top 0.2: AVR.P$11 47.75,28.25 v47.5,28.5
  Bottom 0.2: JTAG_HDR.9 36.25,40.85 36.25,37.25 36.75,36.75 39.25,36.75 v47.5,28.5
JTAG_TDO  (via drill 0.4 pad 0.8)
  Top 0.2: AVR.P$13 47.65,26.65 v47.5,26.5
  Bottom 0.2: v47.5,26.5 47.25,26.75 44.5,26.75 39.75,31.5 36.75,31.5 36.25,32 36.25,33.23 JTAG_HDR.3
JTAG_TMS  (via drill 0.4 pad 0.8)
  Top 0.2: AVR.P$10 47.95,29.05 v47.5,29.5 | v37,37.5 JTAG_HDR.5
  Bottom 0.2: v37,37.5 39.5,37.5 v47.5,29.5
LCD_A0  (via drill 0.4 pad 0.8)
  Top 0.2: AVR.P$18 52.25,21.25 v51.25,20.25 | v67,2.25 67.25,2.5 74.5,2.5 v74.75,2.75 | v80.75,2.25 82.5,2.25 84.44,4.19 LCD_HDR.3
  Bottom 0.2: v51.25,20.25 50.25,19.25 50.25,2.75 51,2 66.75,2 v67,2.25 | v74.75,2.75 75.25,2.25 v80.75,2.25
LCD_BL_B-  (via drill 0.4 pad 0.8)
  Top 0.3: R_BLU_LED.2 84.5,9.75 84.75,9.5 v88.75,9.5 | v91,9.5 93.25,7.25 93.25,5.5 94.25,4.5 94.33,4.5 LCD_HDR.11
  Bottom 0.3: v88.75,9.5 v91,9.5
LCD_BL_G-
  Top 0.3: R_GRN_LED.2 89.5,9.75 92,7.25 92,6.83 LCD_HDR.10
LCD_BL_R-  (via drill 0.4 pad 0.8)
  Top 0.3: R_RED_LED.2 94.5,9.75 94.25,9.5 v92.25,9.5
  Bottom 0.3: v92.25,9.5 LCD_HDR.8
LCD_RESET  (via drill 0.4 pad 0.8)
  Top 0.2: AVR.P$16 v49.25,20.25 | v75.25,6.75 76.5,6.75 76.58,6.67 R_LCD_RESET.1 77.17,6.67 77.25,6.75 81.88,6.75 LCD_HDR.2
  Bottom 0.2: v49.25,20.25 49.25,2.25 50.5,1 69.5,1 v75.25,6.75
LCD_SCLK  (via drill 0.4 pad 0.8)
  Top 0.2: AVR.P$17 51.45,21.45 v50.25,20.25 | LCD_HDR.4 84.44,6.69 83.25,5.5 81,5.5 79.75,4.25 v79.75,3.5 78.25,2 68.25,2 v68,1.75
  Bottom 0.2: v50.25,20.25 49.75,19.75 49.75,2.5 50.75,1.5 67.75,1.5 v68,1.75
LCD_SID  (via drill 0.4 pad 0.8)
  Top 0.2: AVR.P$19 53.05,21.05 v52.25,20.25 | v66,2.75 66.25,3 73.5,3 v73.75,3.25 | LCD_HDR.5 84,1.25 v80.75,1.25
  Bottom 0.2: v52.25,20.25 50.75,18.75 50.75,3 51.25,2.5 65.75,2.5 v66,2.75 | v73.75,3.25 73.75,2.75 75.25,1.25 v80.75,1.25 80.5,1.25
N$1  (via drill 0.4 pad 0.8)
  Top 0.3: GPS.P$1 76.2,17.8 C_GPS_PWR1.1 76.25,17.65 v76.25,16.25 | BEAD_GPS.2 22.8,2 26.25,2 27.23,2.98 C_GPS_PWR2.+ 27.5,3.23 27.5,3.25 v51.75,3.25
  Bottom 0.3: v51.75,3.25 64.25,3.25 76.25,15.25 v76.25,16.25
N$2
  Top 0.2: C_RTC_XTAL1.1 63,6.98 RTC_XTAL.1 62.77,7.25 62.25,7.25 61.95,7.55 RTC.P$2
N$3
  Top 0.2: C_RTC_XTAL2.1 60.5,6.98 RTC_XTAL.2 | RTC_XTAL.2 60.5,7 | RTC.P$1 61.45,7.45 61.25,7.25 60.73,7.25 RTC_XTAL.2 | 60.5,7.02 RTC_XTAL.2
N$4
  Top 0.2: FTDI.P$3 81.41,52.34 83.95,49.8 FTDI.P$14 FTDI.P$13 87.59,49.16 88.25,48.5 C_FTDI_FLOAT.1
N$5
  Top 0.2: R_CAN_RST2.1 22.1,29.32 22.1,31 C_CAN_RST.1 22.1,33.73 R_CAN_RST1.1
N$6
  Top 0.2: AVR.P$58 56.05,40.55 58.25,42.75 58.25,43.91 AVR_XTAL.1 57.35,44.81 C_AVR_XTAL1.1
N$7
  Top 0.2: AVR.P$59 55.25,40.5 53.25,42.5 53.25,43.91 AVR_XTAL.2 54.15,44.81 C_AVR_XTAL2.1
N$8
  Top 0.2: R_FTDI_RX_LED.1 FTDI_RX_LED.C
N$9
  Top 0.2: MINIUSB.P$3 105.5,42 104.75,42.75 103.35,42.75 C_USB+.1 101.07,42.85 R_USB+.2
N$10
  Top 0.2: MINIUSB.P$2 105.45,41.2 104.75,40.5 103.35,40.5 C_USB-.1 101.07,40.4 R_USB-.2
N$11
  Top 0.2: R_FTDI_TX_LED.1 FTDI_TX_LED.C
N$12
  Top 0.2: R_FTDI_TX_LED.2 79.75,42.75 79.25,43.25 79.25,46.5 80.14,47.39 FTDI.P$10
N$13  (via drill 0.4 pad 0.8)
  Top 0.2: R_FTDI_RX_LED.2 81,45.17 81,46.25 v81.25,46.5 | FTDI.P$17 84.45,51.7 v84.25,51.5
  Bottom 0.2: v81.25,46.5 81.5,46.75 82.5,46.75 83,47.25 83,50.25 v84.25,51.5
N$17  (via drill 0.4 pad 0.8)
  Top 0.2: MINIUSB.P$1 106.15,40.4 v106,40.25 | v104.25,54 104.25,55.42 R_VBUS_HIGH.2
  Bottom 0.2: v106,40.25 106,52.25 v104.25,54
N$18  (via drill 0.4 pad 0.8)
  Top 0.2: R_GRN_PD.2 87.26,14.18 NMOS_GRN.3 v86.27,15.73 86.25,15.75 | AVR.P$37 66.3,27.45 66.75,27 v67,27
  Bottom 0.2: v67,27 68,27 74.75,20.25 77.75,20.25 82.27,15.73 v86.27,15.73
N$19  (via drill 0.4 pad 0.8)
  Top 0.2: R_BLU_PD.2 82.26,14.18 NMOS_BLU.3 81.27,15.73 v81.25,15.75 | AVR.P$36 66.35,26.65 66.75,26.25 v67.75,26.25
  Bottom 0.2: v67.75,26.25 68,26.25 74.5,19.75 77.5,19.75 81.25,16 v81.25,15.75
N$20
  Top 0.2: CAN_CTRLR.P$9 25.27,16.98 27.41,14.84 CAN_XTAL.2 27.41,12.41 26.75,11.75 26.75,10.15 C_CAN_XTAL1.1
N$21
  Top 0.2: CAN_CTRLR.P$8 24.62,16.88 22.59,14.84 CAN_XTAL.1 22.59,12.41 23.25,11.75 23.25,10.15 C_CAN_XTAL2.1
N$22
  Top 0.2: CAN_CTRLR.P$19 20.73,24.48 22.25,26 R_CAN_RST2.2
N$23  (via drill 0.4 pad 0.8)
  Top 0.3: AVR.P$61 53.65,37.1 v54.75,36 | v49.5,38 47,38 46.5,37.5 46.5,32.75 v44,30.25 | C_AVR_ANALOG_LOCAL.+ 37.93,22.45 BEAD_AVR_ANALOG.1 43.8,22.45 44.25,22 45.75,22 46.25,22.5 46.25,28 v46,28.25
  Bottom 0.3: C_AVR_ANALOG.1 v54.75,36 51.5,36 v49.5,38 | v46,28.25 v44,30.25
N$24
  Top 0.3: R_PWR_LED.2 13.17,4.42 PWR_LED.C
N$27  (via drill 0.4 pad 0.8)
  Top 0.2: R_RED_PD.2 92.26,14.18 NMOS_RED.3 91.27,15.73 v91.25,15.75 | AVR.P$38 66.5,28.25 67,27.75 v67.75,27.75
  Bottom 0.2: v67.75,27.75 68,27.75 75,20.75 78,20.75 82.5,16.25 85.75,16.25 86,16.5 86.5,16.5 87.25,15.75 v91.25,15.75
N$28  (via drill 0.4 pad 0.8)
  Top 0.3: AVR.P$53 60.05,36.3 v59.75,36 | AVR.P$45 63.9,33.85 63.25,34.5 v61.25,34.5 | AVR.P$35 63.65,25.85 63.25,26.25 v61.25,26.25 | AVR.P$25 57.85,23.65 57.25,24.25 v57.25,24.5 | v53.25,26 52,26 51.05,25.05 AVR.P$15 48.05,25.05 47.75,24.75 47.75,19 47.25,18.5 41.8,18.5 BEAD_AVR_ANALOG.2 41.7,18.5 39.25,18.5 v38.75,18 | C_AVR_PWR.+ 15.5,14.7 L_AVR_PWR.1
  Bottom 0.3: v59.75,36 57.5,36 57.25,35.75 C4.1 57.35,34.5 59.85,34.5 | 59.85,34.5 v61.25,34.5 v61.25,26.25 59.9,26.25 C2.1 C1.1 | 59.85,34.5 C3.1 | C1.1 C5.1 54.65,26 v53.25,26 | v57.25,24.5 C1.1 | v38.75,18 35,18 33,20 17.27,20 C_AVR_PWR.+
N$29
  Top 0.3: NMOS_BLU.2 84.19,14.23 R_BLU_LED.1
N$30
  Top 0.3: NMOS_GRN.2 89.19,14.23 R_GRN_LED.1
N$31
  Top 0.3: NMOS_RED.2 94.19,14.23 R_RED_LED.1
PDI_DATA
  Top 0.2: AVR.P$56 57.65,39.4 58,39.75 60.5,39.75 62.75,42 62.75,55.5 61.25,57 59.81,57 PDI_HDR.1
RESET
  Top 0.2: SW_RESET.2 48.54,58.21 48.25,58.5 R_RESET_PU.1 | SW_RESET.2 48.63,56.25 51,56.25 51.75,57 54.5,57 54.52,57.02 PDI_HDR.5 55.23,56.5 55.25,56.5 56,55.75 61.75,55.75 62.25,55.25 62.25,42.25 60.25,40.25 57.75,40.25 56.85,39.35 AVR.P$57 | JTAG_HDR.6 32,37.5 33.25,38.75 33.25,47.25 40.25,54.25 48,54.25 48.54,54.79 SW_RESET.2
RTC_INT  (via drill 0.4 pad 0.8)
  Top 0.2: AVR.P$47 67.05,35.45 v70.75,31.75 | v74.5,22.25 73.5,22.25 68.75,17.5 v65.25,17.5 R_RTC_INT.1 63.75,17.42 63.75,15.5 63.5,15.25 62.25,15.25 61.95,14.95 RTC.P$9
  Bottom 0.2: v70.75,31.75 73,29.5 73,23.5 74.25,22.25 v74.5,22.25
RTC_MISO  (via drill 0.4 pad 0.8)
  Top 0.2: AVR.P$22 55.45,20.8 58.25,18.25 v58.5,18.25 | RTC.P$7 62.95,12.55 v63,12.5
  Bottom 0.2: v63,12.5 62.25,11.75 61.75,11.75 60,13.5 60,16.75 v58.5,18.25
RTC_MOSI  (via drill 0.4 pad 0.8)
  Top 0.2: AVR.P$21 54.65,20.85 57.75,17.75 v57.75,17.5 | RTC.P$6 63.45,13.05 v64,12.5
  Bottom 0.2: v64,12.5 62.75,11.25 61.5,11.25 59.5,13.25 59.5,15.75 v57.75,17.5
RTC_SCK  (via drill 0.4 pad 0.8)
  Top 0.2: AVR.P$23 56.25,20.75 57.75,19.25 v58.75,19.25 | RTC.P$8 62.45,12.95 v62,12.5
  Bottom 0.2: v62,12.5 60.5,14 60.5,17.5 v58.75,19.25
RTC_SS  (via drill 0.4 pad 0.8)
  Top 0.2: AVR.P$20 53.85,20.9 56.75,18 v56.75,17.25 | RTC.P$4 62.95,10.55 62.5,11 v60.75,11 60,10.25 58.92,10.25 R_RTC_SS.2
  Bottom 0.2: v56.75,17.25 59,15 59,13 60.75,11.25 v60.75,11
SD_DAT1  (via drill 0.4 pad 0.8)
  Top 0.2: MICROSD.P$8 113,26.75 v113.5,26.25 | AVR.P$6 v63.5,32.25 | v69.75,31.25 70,31 74.5,31 78,27.5 96.5,27.5 98.75,25.25 v102,25.25
  Bottom 0.2: v63.5,32.25 64,32.75 67,32.75 68.75,31 69.5,31 v69.75,31.25 | v102,25.25 102.25,25 112.25,25 v113.5,26.25
SD_DAT2  (via drill 0.4 pad 0.8)
  Top 0.2: MICROSD.P$1 113.3,19.05 v113.5,19.25 | AVR.P$7 50.45,31.45 50.75,31.75 61.5,31.75 v63.5,29.75 | v69.75,27.75 70,28 73,28 76.5,24.5 94.75,24.5 v96,23.25
  Bottom 0.2: v63.5,29.75 67.75,29.75 v69.75,27.75 | v96,23.25 96,22.25 96.5,21.75 97.75,21.75 100.5,19 113.25,19 v113.5,19.25
SD_DETECT  (via drill 0.4 pad 0.8)
  Top 0.2: AVR.P$39 66.95,29.05 67.5,28.5 73.25,28.5 76.75,25 95.25,25 98.25,22 99.25,22 v99.5,21.75 | MICROSD.P$9 108.38,17.12 v108.25,17.25 | R_SD_DETECT.1 107.75,14.5 108.25,15 v108.25,17.25 | v102,19.75 102,18.25 102.5,17.75 107.75,17.75 v108.25,17.25
  Bottom 0.2: v99.5,21.75 100.5,21.75 102,20.25 v102,19.75
SD_MISO  (via drill 0.4 pad 0.8)
  Top 0.2: AVR.P$42 66.8,31.45 68.25,30 74,30 77.5,26.5 96,26.5 98.5,24 v98.75,24 | MICROSD.P$7 113.1,25.65 v113.5,25.25
  Bottom 0.2: v98.75,24 99.25,24 100,24.75 100.5,24.75 100.75,24.5 112.75,24.5 v113.5,25.25
SD_MOSI  (via drill 0.4 pad 0.8)
  Top 0.2: MICROSD.P$3 v113.5,21.25 | AVR.P$41 66.85,30.65 68,29.5 73.75,29.5 77.25,26 95.75,26 98.75,23 99.25,23 v99.5,23.25
  Bottom 0.2: v99.5,23.25 100.5,23.25 103,20.75 113,20.75 v113.5,21.25
SD_SCK  (via drill 0.4 pad 0.8)
  Top 0.2: MICROSD.P$5 113.3,23.45 v113.5,23.25 | AVR.P$43 66.75,32.25 68.5,30.5 74.25,30.5 77.75,27 96.25,27 98.5,24.75 99.25,24.75 100,24 v100.25,24
  Bottom 0.2: v113.5,23.25 112.75,24 v100.25,24
SD_SS  (via drill 0.4 pad 0.8)
  Top 0.2: AVR.P$40 66.9,29.85 67.75,29 73.5,29 77,25.5 95.5,25.5 98.5,22.5 v100.25,22.5 | MICROSD.P$2 113.4,20.15 v113.5,20.25 | R_SD_SS.2 96.25,22 v96.75,22.5
  Bottom 0.2: v113.5,20.25 102.75,20.25 100.5,22.5 v100.25,22.5 v96.75,22.5
USB_N  (via drill 0.33 pad 0.8, 0.4 pad 0.8)
  Top 0.2: FTDI.P$12 87.22,48.53 v87.5,48.25 | v95.5,40.25 R_USB-.1
  Bottom 0.2: v87.5,48.25 88.25,47.5 88.25,47.25 91.75,43.75 92,43.75 v95.5,40.25
USB_P  (via drill 0.33 pad 0.8, 0.4 pad 0.8)
  Top 0.2: FTDI.P$11 86.86,47.89 v87.5,47.25 | v91.75,43 92.25,43 92.5,43.25 92.75,43.25 93.25,42.75 93.5,42.75 94,43.25 94.25,43.25 94.75,42.75 95,42.75 95.5,43.25 95.75,43.25 96.25,42.75 96.5,42.75 96.75,43 R_USB+.1
  Bottom 0.2: v87.5,47.25 v91.75,43
VBACKUP  (via drill 0.4 pad 0.8)
  Top 0.2: C_GPS_BATT.+ 54.48,8.25 | 54.48,8.25 54.48,9.22 RTC_BATT.P$1 | RTC.P$3 62.45,8.55 v62.75,8.25 63.75,8.25 70.75,15.25 76.5,15.25 80.7,19.45 GPS.P$4 | v57,8.25 54.48,8.25
  Bottom 0.2: v62.75,8.25 v57,8.25
VBUS_SENSE  (via drill 0.4 pad 0.8)
  Top 0.2: R_VBUS_HIGH.1 R_VBUS_LOW.2 99,55.42 v99,54 | FTDI.P$18 87.34,52.34 v87.75,52.75
  Bottom 0.2: v87.75,52.75 98.5,52.75 99,53.25 v99,54

### Text on the board
tDocu: AUTOMATON / Justin Gottula | 2014.01.16 / HW v3 / PCB r1